# Altium project SCH-29364_a.PrjPcb (part 1 of 3)
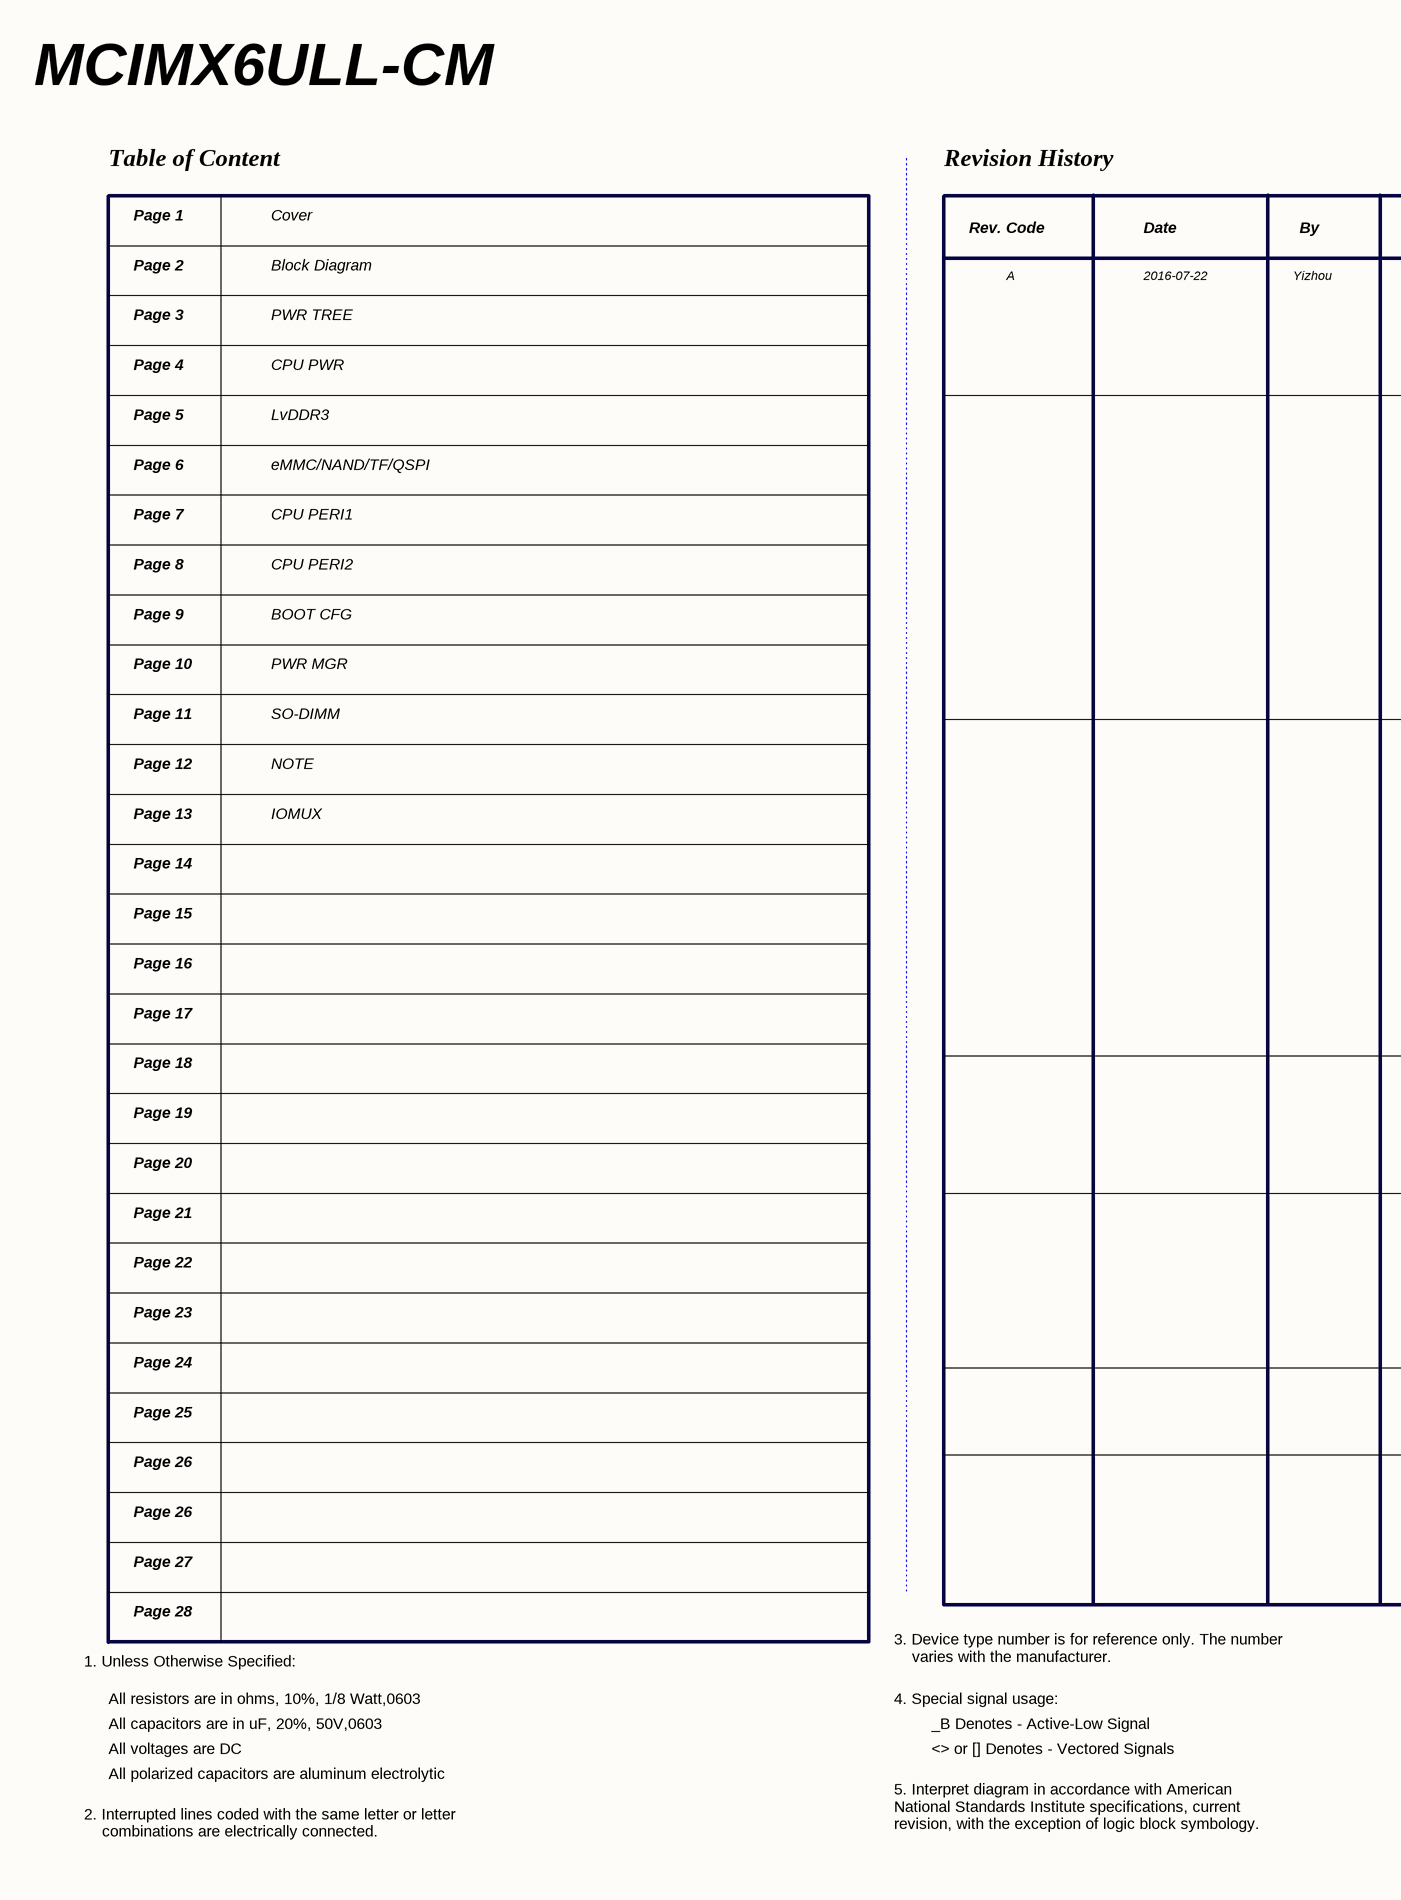
[diagram p0: A-00 COVER.SchDoc, left]
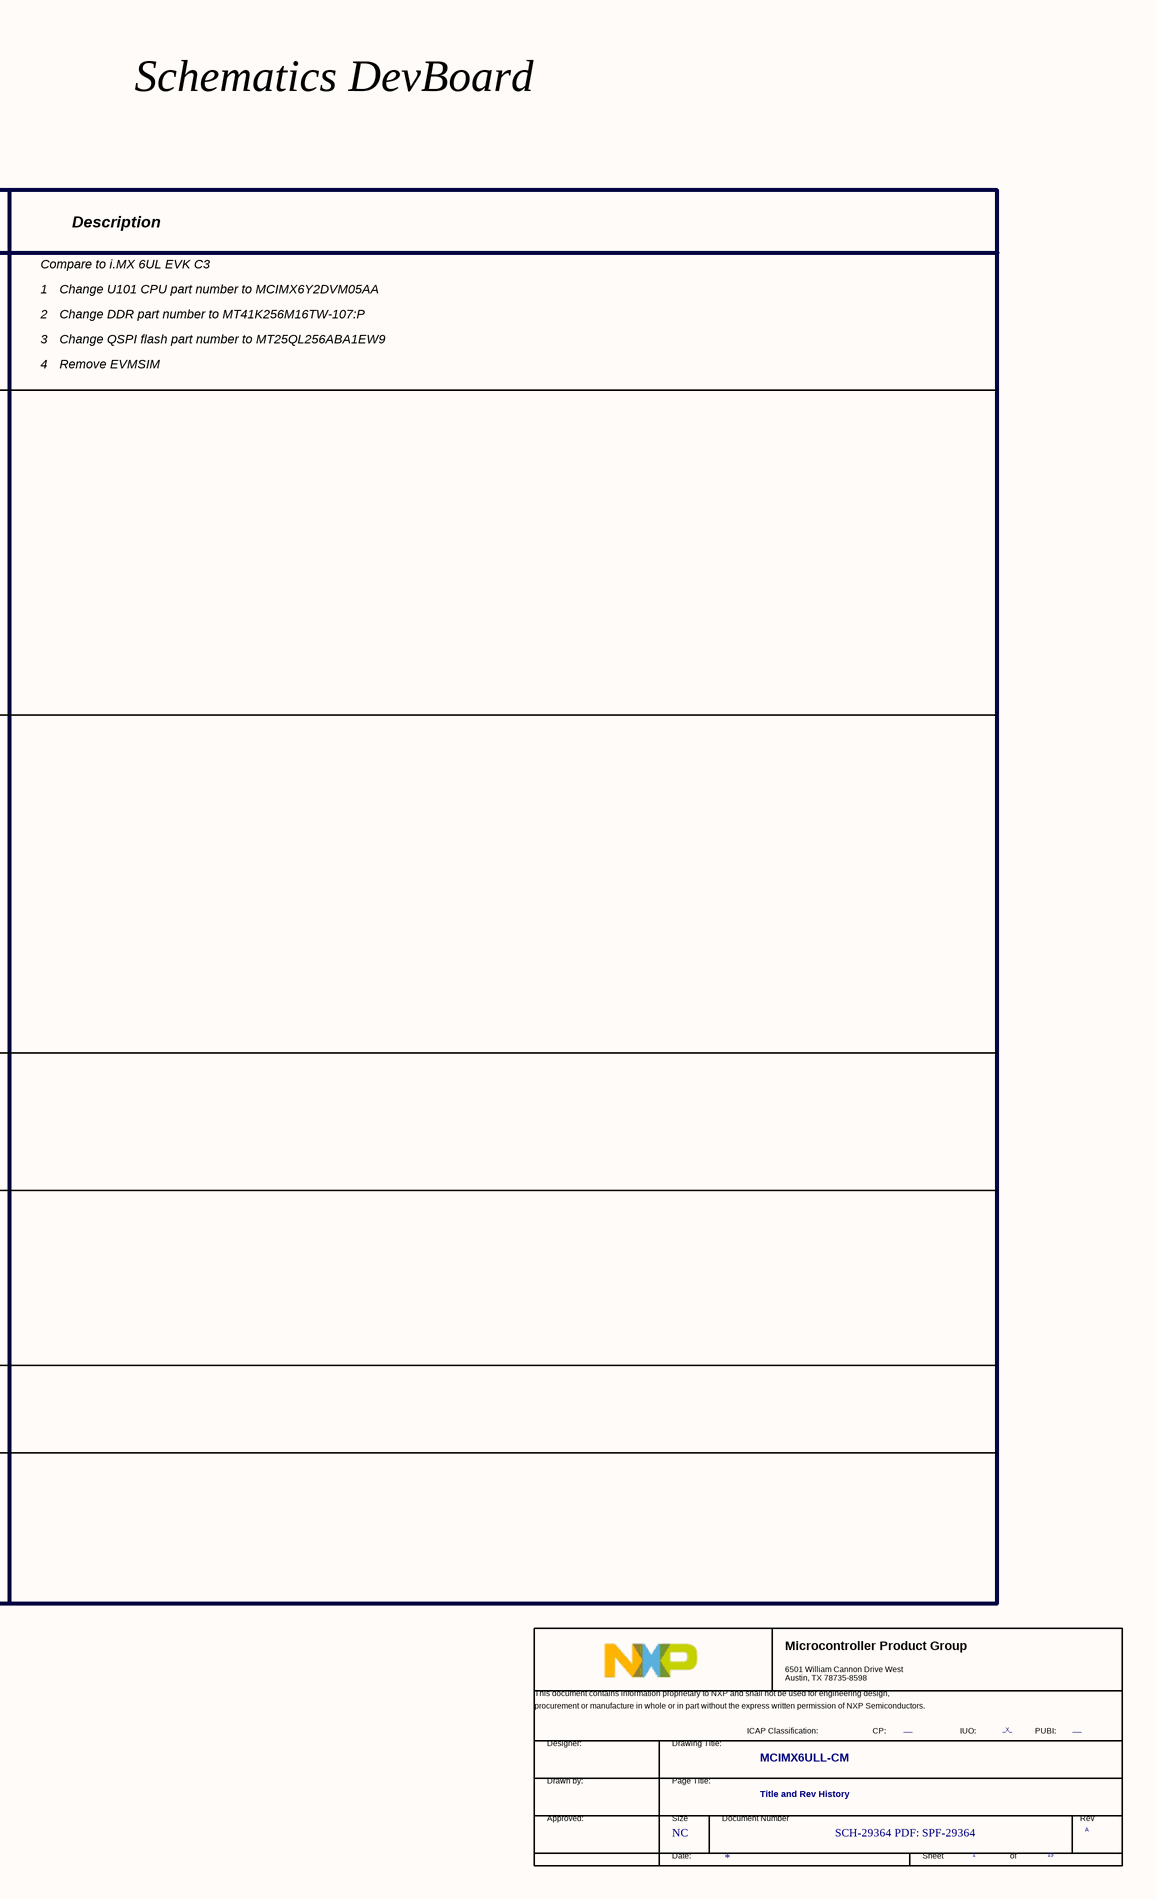
[diagram p1: A-00 COVER.SchDoc, right]
12 sheets, 344 parts. Net scope: global (net labels, ports and power ports of the same name join across sheets).
Board file: PCB1.PcbDoc
Sheets:
  A-00 COVER.SchDoc
  A-01 BLOCK DIAGRAM.SchDoc
  A-02 PWR TREE.SchDoc
  C-01 CPU PWR.SchDoc
  C-02 LvDDR3.SchDoc
  C-03 eMMC_NAND_TF_QSPI.SchDoc
  C-04 CPU PERI1.SchDoc
  C-05 CPU PERI2.SchDoc
  C-06 BOOT CFG.SchDoc
  C-07 PWR MGR.SchDoc
  X-01 NOTE.SchDoc
  X-02 IOMUX.SchDoc

## Sheet A-00 COVER.SchDoc
size 513 x 386 mm

### Parts
(Parts that share a designator on the sheet are numbered #1, #2 ... from top to bottom, then left to right.)
*#1  Doc: SCH-29364 PDF: SPF-29364  RevCode: A  Title: MCIMX6ULL-CM  Page Size: NC  Page Number: 1  Page Count: 13  PageTitle: Title and Rev History  PUBI: ___  FIUO: _X_  (hidden comment: TitleBlock_MCPG)  (graphical)

### Notes on the sheet
- MCIMX6ULL-CM
- Schematics DevBoard
- Table of Content
- Page 1
- Cover
- Revision History
- Page 2
- Block Diagram
- Rev. Code
- A
- Date
- 2016-07-22
- Yizhou
- By
- Compare to i.MX 6UL EVK C3
- Description
- Page 3
- PWR TREE
- 1
- 2
- Change U101 CPU part number to MCIMX6Y2DVM05AA
- Change DDR part number to MT41K256M16TW-107:P
- Page 4
- CPU PWR
- 3
- 4
- Change QSPI flash part number to MT25QL256ABA1EW9
- Remove EVMSIM
- Page 5
- Page 6
- LvDDR3
- eMMC/NAND/TF/QSPI
- Page 7
- CPU PERI1
- Page 8
- CPU PERI2
- Page 9
- BOOT CFG
- Page 10
- Page 11
- SO-DIMM
- PWR MGR
- Page 12
- NOTE
- Page 13
- IOMUX
- Page 14
- Page 15
- Page 16
- Page 17
- Page 18
- Page 19
- Page 20
- Page 21
- Page 22
- Page 23
- Page 24
- Page 25
- Page 26
- Page 27
- Page 28
- 3. Device type number is for reference only. The number
  varies with the manufacturer.
- 1. Unless Otherwise Specified:
- All resistors are in ohms, 10%, 1/8 Watt,0603
- 4. Special signal usage:
- All capacitors are in uF, 20%, 50V,0603
- All voltages are DC
- All polarized capacitors are aluminum electrolytic
- 5. Interpret diagram in accordance with American
  National Standards Institute specifications, current
  revision, with the exception of logic block symbology.
- _B Denotes - Active-Low Signal
- <> or [] Denotes - Vectored Signals
- 2. Interrupted lines coded with the same letter or letter
  combinations are electrically connected.
- (in symbol TitleBlock_MCPG) Microcontroller Product Group; 6501 William Cannon Drive West / Austin, TX 78735-8598; This document contains information proprietary to NXP and shall not be used for engineering design,; procurement or manufacture in whole or in part without the express written permission of NXP Semiconductors.; ICAP Classification:; CP:; IUO:; PUBI:; Designer:; Drawing Title:; Drawn by:; Page Title:; Approved:; Size; Document Number; Rev; Date:; Sheet; of

### Library data of the parts
*#1 = TitleBlock_MCPG: OrgAddr2: Austin, TX 78735-8598; OrgAddr1: 6501 William Cannon Drive West; OrgName: Freescale Semiconductor; Page Create Date: March  8, 1995; FCP: ___; Page Modify Date: *

## Sheet A-01 BLOCK DIAGRAM.SchDoc
size 513 x 386 mm
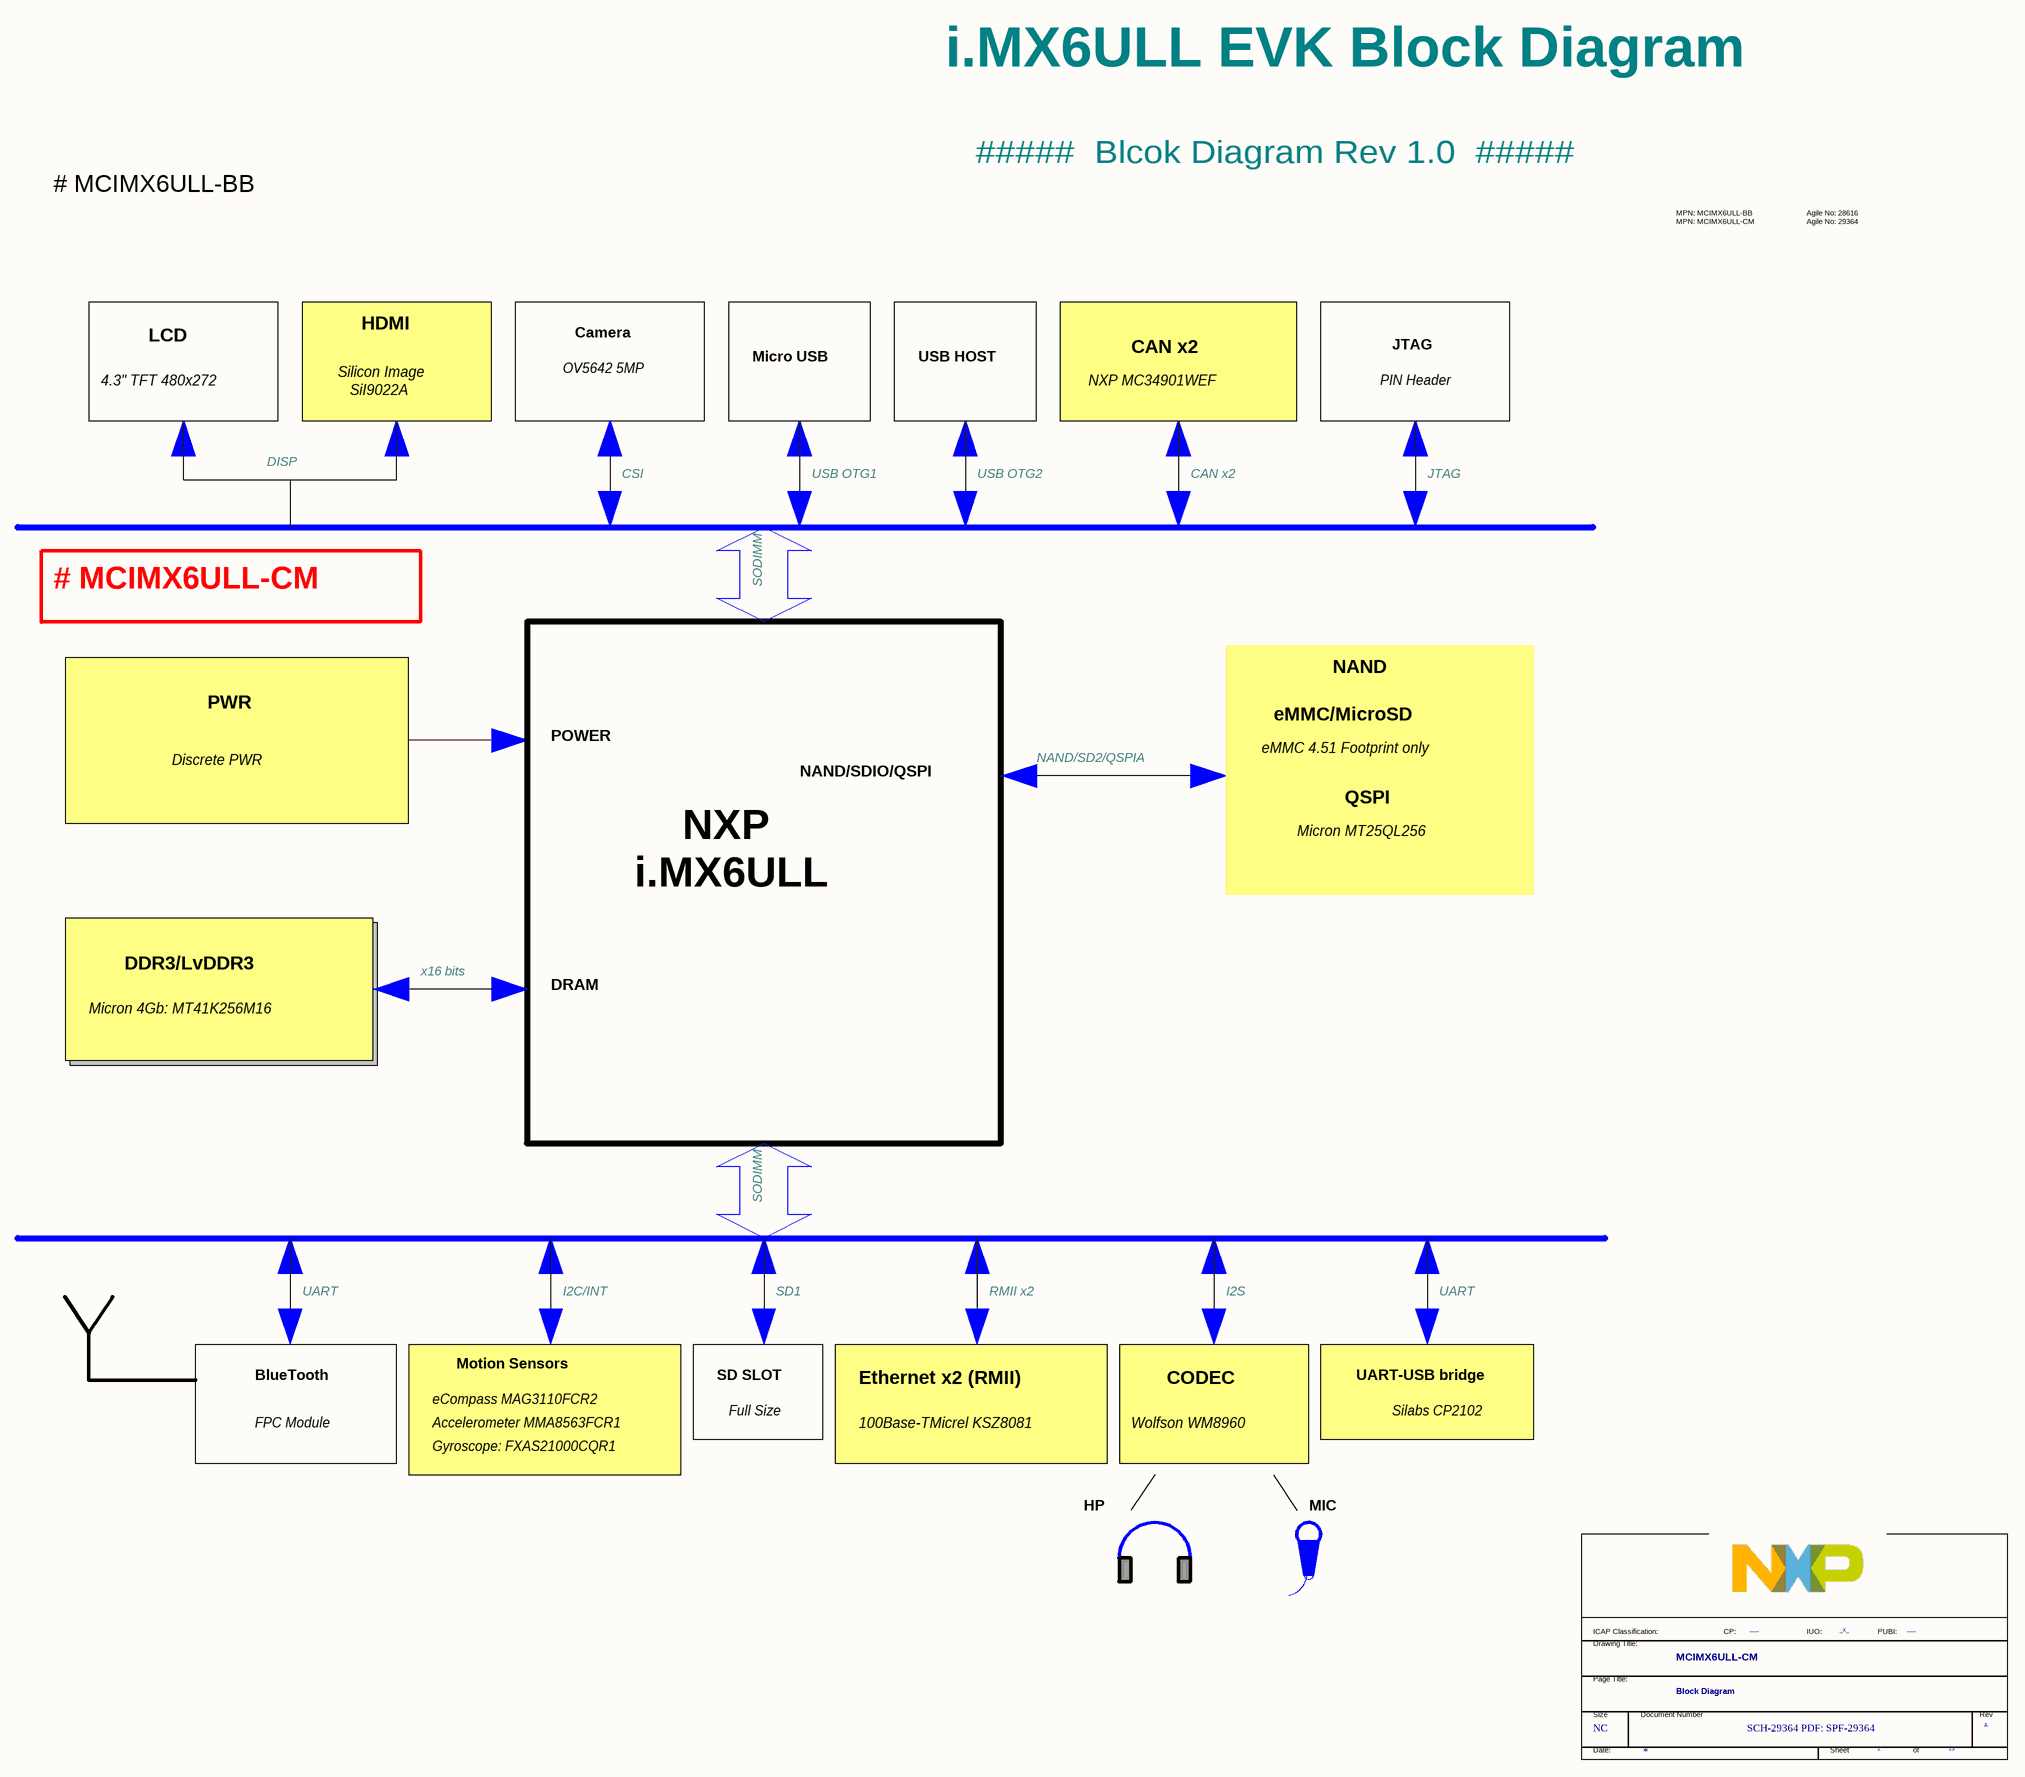
[diagram p2: A-01 BLOCK DIAGRAM.SchDoc]

### Parts
(Parts that share a designator on the sheet are numbered #1, #2 ... from top to bottom, then left to right.)
*#2  FIUO: _X_  PUBI: ___  Doc: SCH-29364 PDF: SPF-29364  RevCode: A  Title: MCIMX6ULL-CM  Page Size: NC  Page Number: 2  Page Count: 13  PageTitle: Block Diagram  (hidden comment: TitleBlock_FS)  (graphical)

### Notes on the sheet
- i.MX6ULL EVK Block Diagram
- # MCIMX6ULL-BB
- #####  Blcok Diagram Rev 1.0  #####
- MPN: MCIMX6ULL-BB
  MPN: MCIMX6ULL-CM
- Agile No: 28616
  Agile No: 29364
- LCD
- Silicon Image
  SiI9022A
- HDMI
- OV5642 5MP
- Camera
- Micro USB
- USB HOST
- CAN x2
- JTAG
- 4.3" TFT 480x272
- NXP MC34901WEF
- PIN Header
- DISP
- CSI
- USB OTG1
- USB OTG2
- # MCIMX6ULL-CM
- SODIMM
- PWR
- eMMC/MicroSD
- NAND
- Discrete PWR
- POWER
- NAND/SDIO/QSPI
- NAND/SD2/QSPIA
- eMMC 4.51 Footprint only
- NXP
  i.MX6ULL
- Micron MT25QL256
- QSPI
- Micron 4Gb: MT41K256M16
- DDR3/LvDDR3
- x16 bits
- DRAM
- UART
- I2C/INT
- SD1
- RMII x2
- I2S
- BlueTooth
- Motion Sensors
- SD SLOT
- UART-USB bridge
- FPC Module
- eCompass MAG3110FCR2
- Accelerometer MMA8563FCR1
- Full Size
- Ethernet x2 (RMII)
- 100Base-TMicrel KSZ8081
- Wolfson WM8960
- CODEC
- Silabs CP2102
- Gyroscope: FXAS21000CQR1
- HP
- MIC
- (in symbol TitleBlock_FS) ICAP Classification:; CP:; IUO:; PUBI:; Drawing Title:; Page Title:; Size; Document Number; Rev; Date:; Sheet; of

### Library data of the parts
*#2 = TitleBlock_FS: OrgName: Freescale Semiconductor; OrgAddr1: 6501 William Cannon Drive West; OrgAddr2: Austin, TX 78735-8598; FCP: ___; Page Create Date: March  8, 1995; Page Modify Date: *

## Sheet A-02 PWR TREE.SchDoc
size 513 x 386 mm
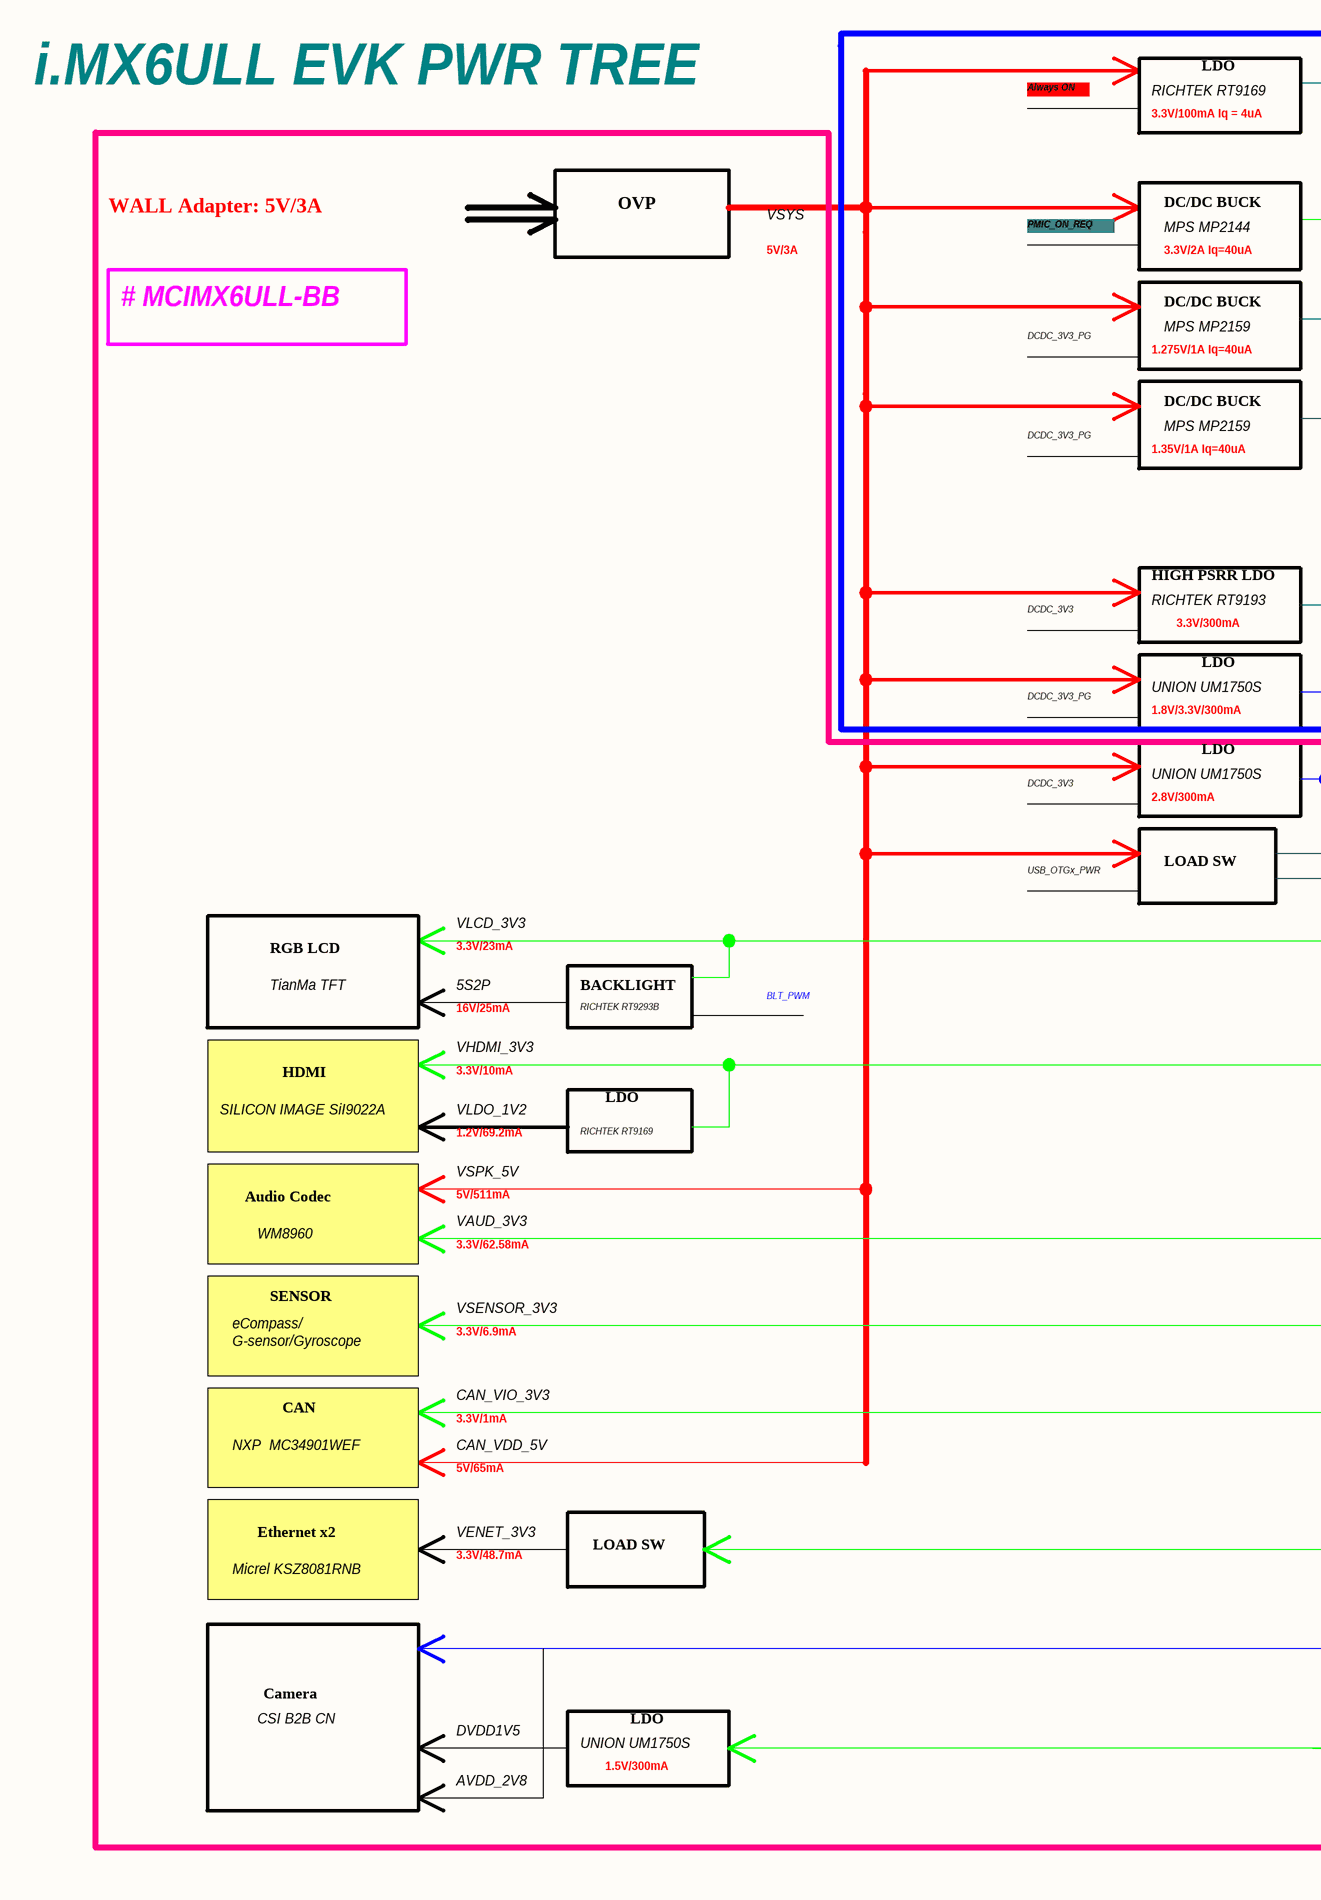
[diagram p3: A-02 PWR TREE.SchDoc, left]
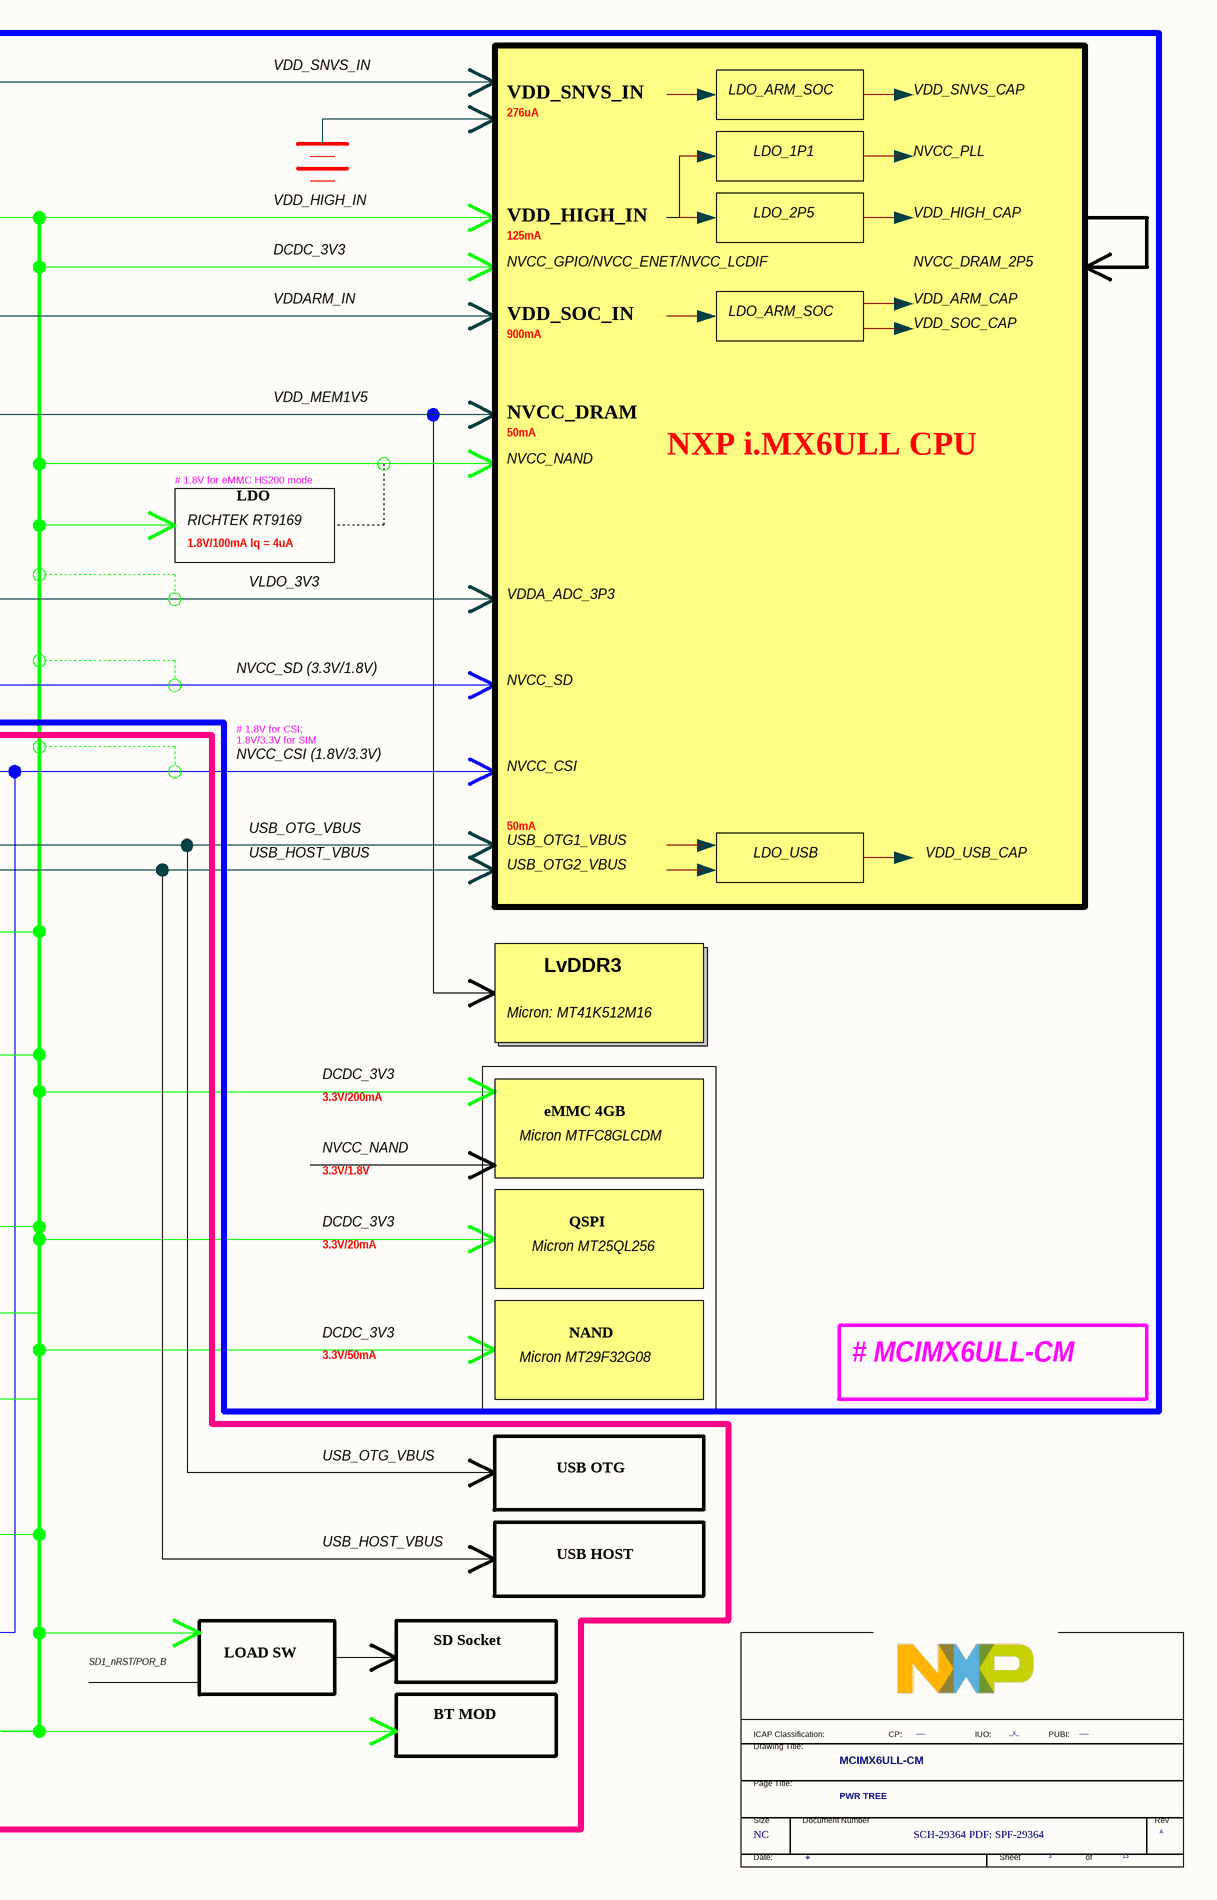
[diagram p4: A-02 PWR TREE.SchDoc, right]

### Parts
(Parts that share a designator on the sheet are numbered #1, #2 ... from top to bottom, then left to right.)
*#3  FIUO: _X_  PUBI: ___  Doc: SCH-29364 PDF: SPF-29364  RevCode: A  Title: MCIMX6ULL-CM  Page Size: NC  Page Number: 3  Page Count: 13  PageTitle: PWR TREE  (hidden comment: TitleBlock_FS)  (graphical)

### Notes on the sheet
- i.MX6ULL EVK PWR TREE
- Always ON
- RICHTEK RT9169
- 3.3V/100mA Iq = 4uA
- LDO
- VDD_SNVS_IN
- 276uA
- LDO_ARM_SOC
- VDD_SNVS_CAP
- LDO_1P1
- NVCC_PLL
- WALL Adapter: 5V/3A
- OVP
- VSYS
- PMIC_ON_REQ
- DC/DC BUCK
- MPS MP2144
- VDD_HIGH_IN
- 125mA
- LDO_2P5
- VDD_HIGH_CAP
- 5V/3A
- 3.3V/2A Iq=40uA
- DCDC_3V3
- VDDARM_IN
- NVCC_GPIO/NVCC_ENET/NVCC_LCDIF
- NVCC_DRAM_2P5
- VDD_ARM_CAP
- # MCIMX6ULL-BB
- DCDC_3V3_PG
- 1.275V/1A Iq=40uA
- MPS MP2159
- 900mA
- VDD_SOC_IN
- VDD_SOC_CAP
- VDD_MEM1V5
- NVCC_DRAM
- 1.35V/1A Iq=40uA
- # 1.8V for eMMC HS200 mode
- NVCC_NAND
- 50mA
- NXP i.MX6ULL CPU
- 1.8V/100mA Iq = 4uA
- RICHTEK RT9193
- HIGH PSRR LDO
- VLDO_3V3
- VDDA_ADC_3P3
- 3.3V/300mA
- NVCC_SD (3.3V/1.8V)
- UNION UM1750S
- 1.8V/3.3V/300mA
- NVCC_SD
- 2.8V/300mA
- NVCC_CSI (1.8V/3.3V)
- # 1.8V for CSI;
  1.8V/3.3V for SIM
- NVCC_CSI
- LOAD SW
- USB_HOST_VBUS
- USB_OTG_VBUS
- USB_OTG1_VBUS
- LDO_USB
- VDD_USB_CAP
- VLCD_3V3
- USB_OTGx_PWR
- USB_OTG2_VBUS
- TianMa TFT
- RGB LCD
- 5S2P
- 3.3V/23mA
- BACKLIGHT
- LvDDR3
- VHDMI_3V3
- 16V/25mA
- RICHTEK RT9293B
- BLT_PWM
- Micron: MT41K512M16
- SILICON IMAGE SiI9022A
- HDMI
- VLDO_1V2
- 3.3V/10mA
- 3.3V/200mA
- VSPK_5V
- 1.2V/69.2mA
- Micron MTFC8GLCDM
- eMMC 4GB
- Audio Codec
- WM8960
- VAUD_3V3
- 5V/511mA
- 3.3V/1.8V
- QSPI
- SENSOR
- 3.3V/62.58mA
- 3.3V/20mA
- Micron MT25QL256
- eCompass/
  G-sensor/Gyroscope
- 3.3V/6.9mA
- VSENSOR_3V3
- NAND
- CAN
- 3.3V/1mA
- CAN_VIO_3V3
- 3.3V/50mA
- Micron MT29F32G08
- # MCIMX6ULL-CM
- NXP  MC34901WEF
- 5V/65mA
- CAN_VDD_5V
- USB OTG
- Ethernet x2
- VENET_3V3
- Micrel KSZ8081RNB
- 3.3V/48.7mA
- USB HOST
- SD Socket
- CSI B2B CN
- Camera
- DVDD1V5
- SD1_nRST/POR_B
- BT MOD
- AVDD_2V8
- 1.5V/300mA
- (in symbol TitleBlock_FS) ICAP Classification:; CP:; IUO:; PUBI:; Drawing Title:; Page Title:; Size; Document Number; Rev; Date:; Sheet; of

### Library data of the parts
*#3 = TitleBlock_FS: OrgAddr2: Austin, TX 78735-8598; OrgAddr1: 6501 William Cannon Drive West; OrgName: Freescale Semiconductor; FCP: ___; Page Create Date: March  8, 1995; Page Modify Date: *

## Sheet C-01 CPU PWR.SchDoc
size 513 x 386 mm
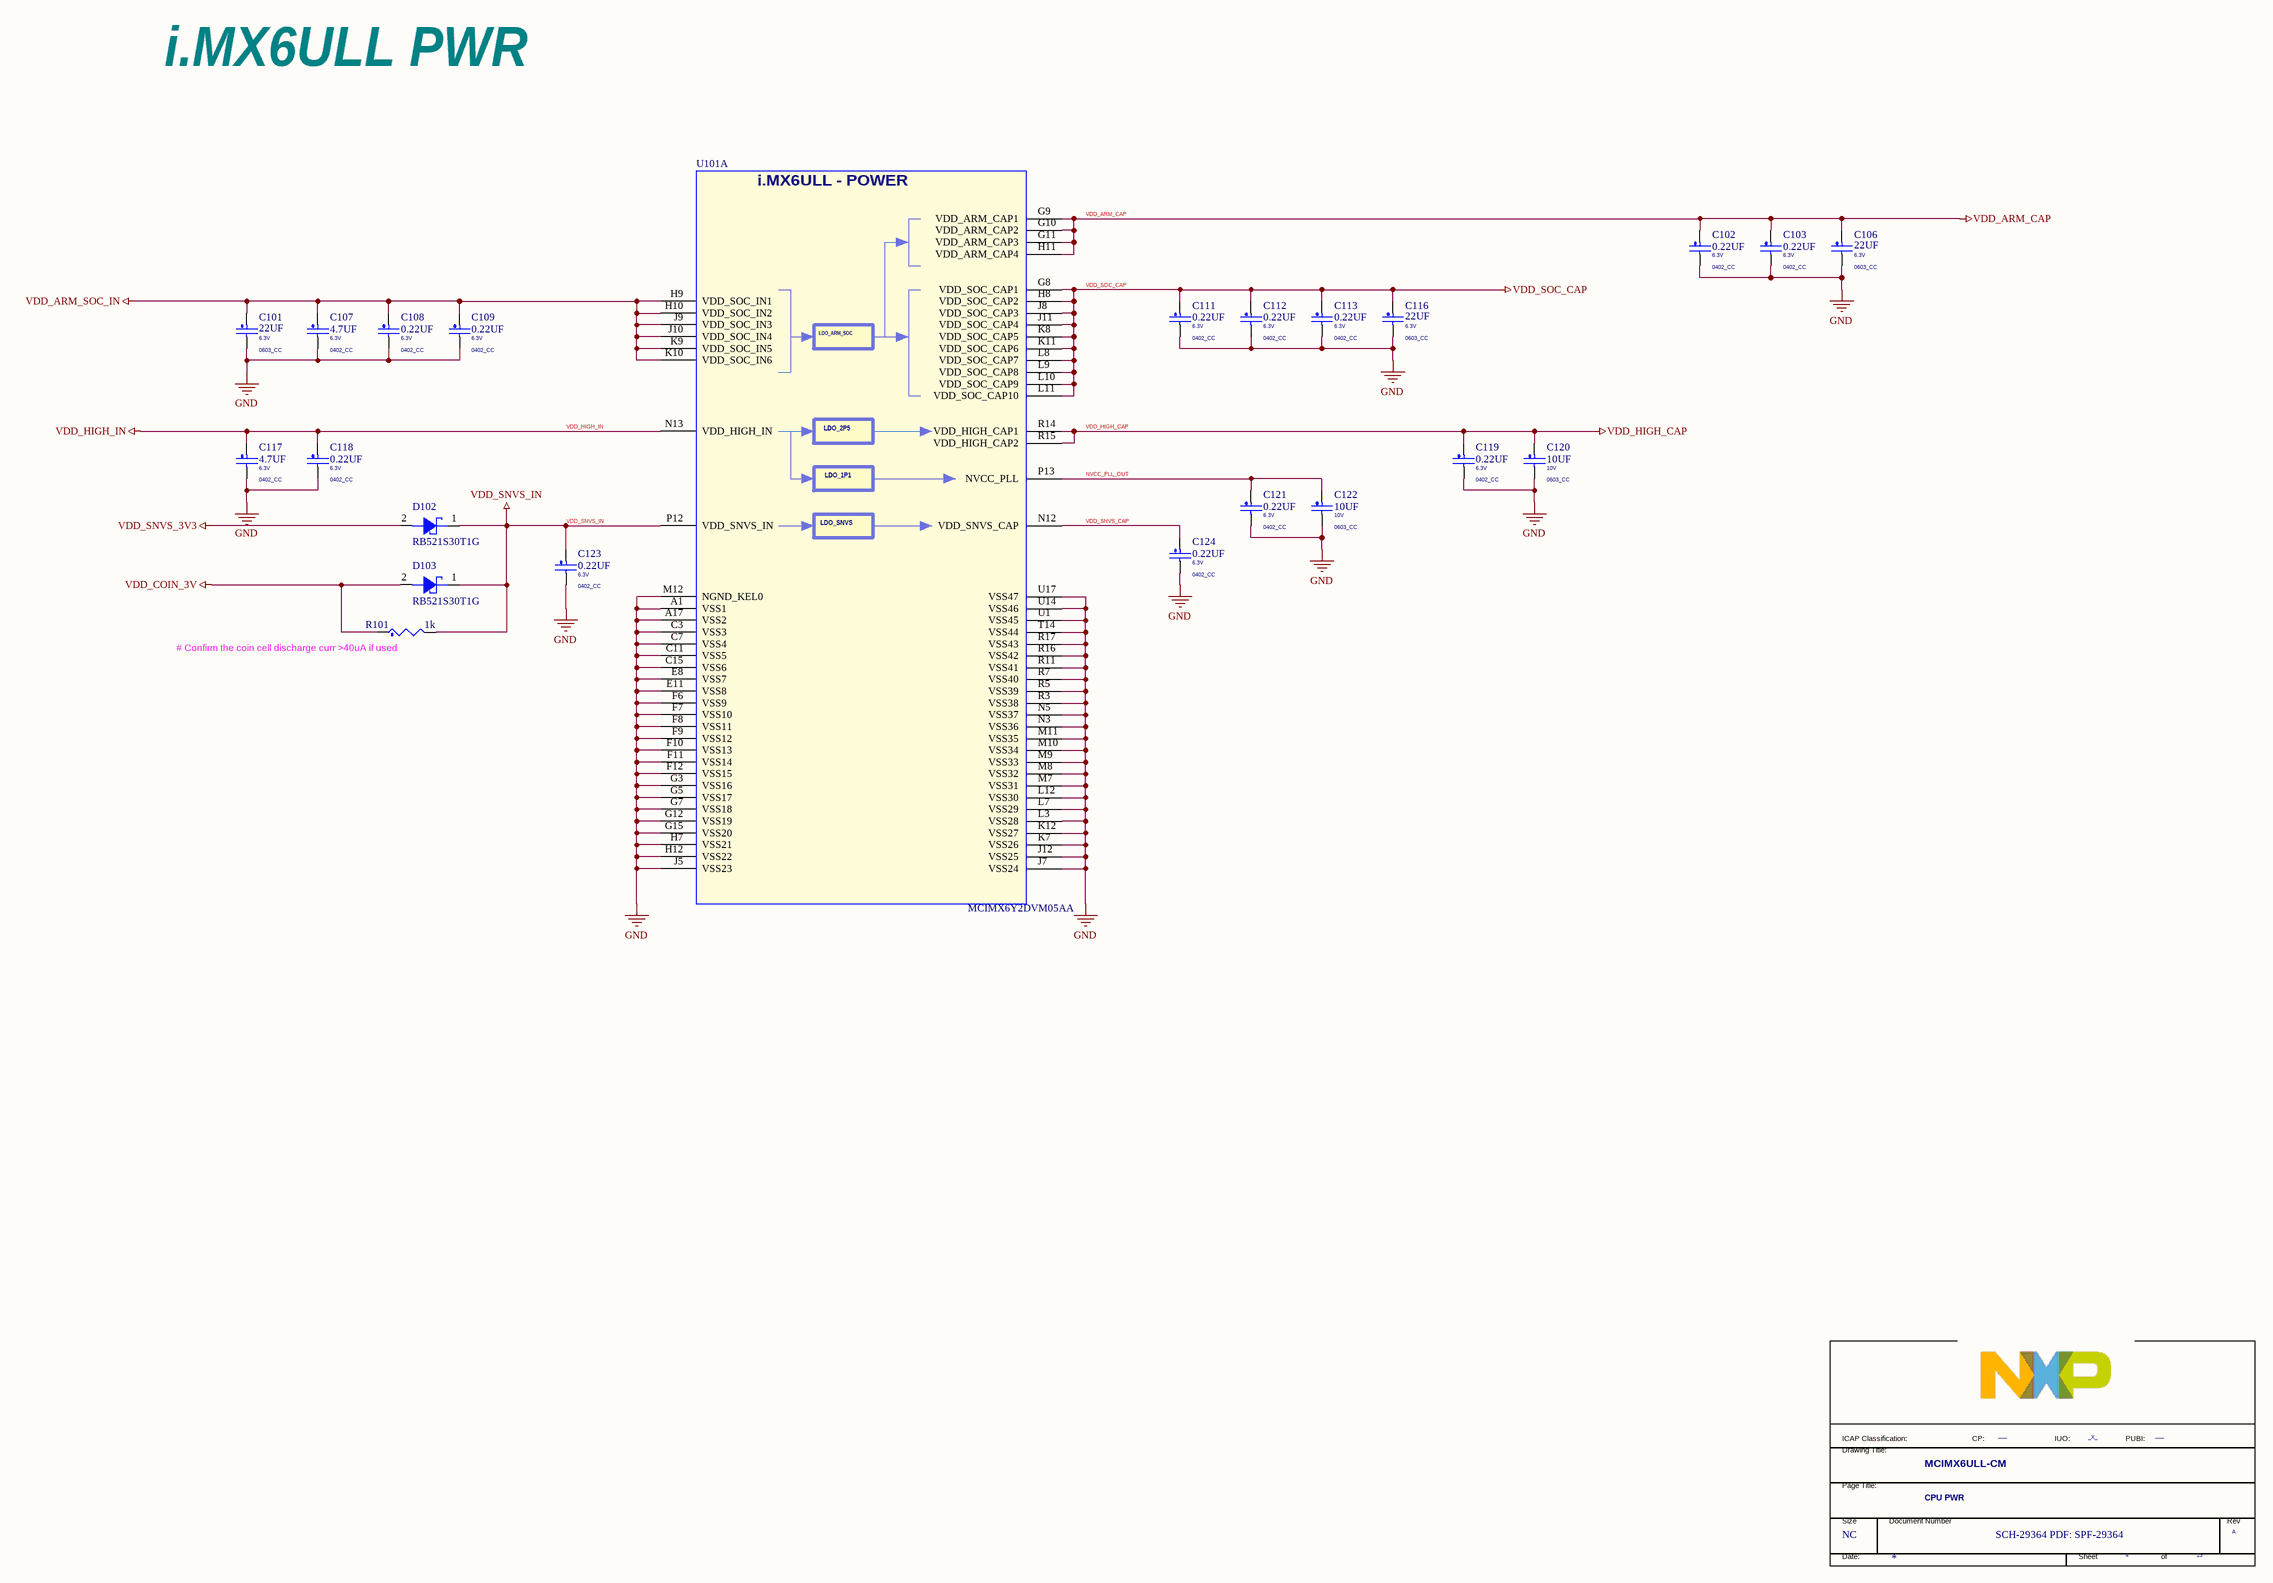
[diagram p5: C-01 CPU PWR.SchDoc]

### Parts
(Parts that share a designator on the sheet are numbered #1, #2 ... from top to bottom, then left to right.)
*#4  FIUO: _X_  PUBI: ___  Doc: SCH-29364 PDF: SPF-29364  RevCode: A  Title: MCIMX6ULL-CM  Page Size: NC  Page Number: 4  Page Count: 13  PageTitle: CPU PWR  (hidden comment: TitleBlock_FS)  (graphical)
C101  22UF  voltage rating: 6.3V  PCB Footprint: 0603_CC  [C0603_H0.8mm]  (net tie, no BOM)
C102  0.22UF  VOLTAGE: 6.3V  PCB Footprint: 0402_CC  [C0402_H0.5mm]
C103  0.22UF  VOLTAGE: 6.3V  PCB Footprint: 0402_CC  [C0402_H0.5mm]
C106  22UF  VOLTAGE: 6.3V  PCB Footprint: 0603_CC  [C0603_H0.8mm]
C107  4.7UF  voltage rating: 6.3V  PCB Footprint: 0402_CC  [C0402_H0.5mm]
C108  0.22UF  VOLTAGE: 6.3V  PCB Footprint: 0402_CC  [C0402_H0.5mm]
C109  0.22UF  VOLTAGE: 6.3V  PCB Footprint: 0402_CC  [C0402_H0.5mm]
C111  0.22UF  VOLTAGE: 6.3V  PCB Footprint: 0402_CC  [C0402_H0.5mm]
C112  0.22UF  VOLTAGE: 6.3V  PCB Footprint: 0402_CC  [C0402_H0.5mm]
C113  0.22UF  VOLTAGE: 6.3V  PCB Footprint: 0402_CC  [C0402_H0.5mm]
C116  22UF  VOLTAGE: 6.3V  PCB Footprint: 0603_CC  [C0603_H0.8mm]
C117  4.7UF  voltage rating: 6.3V  PCB Footprint: 0402_CC  [C0402_H0.5mm]
C118  0.22UF  VOLTAGE: 6.3V  PCB Footprint: 0402_CC  [C0402_H0.5mm]
C119  0.22UF  VOLTAGE: 6.3V  PCB Footprint: 0402_CC  [C0402_H0.5mm]
C120  10UF  VOLTAGE: 10V  PCB Footprint: 0603_CC  [C0603_H0.8mm]
C121  0.22UF  VOLTAGE: 6.3V  PCB Footprint: 0402_CC  [C0402_H0.5mm]
C122  10UF  VOLTAGE: 10V  PCB Footprint: 0603_CC  [C0603_H0.8mm]
C123  0.22UF  VOLTAGE: 6.3V  PCB Footprint: 0402_CC  [C0402_H0.5mm]
C124  0.22UF  VOLTAGE: 6.3V  PCB Footprint: 0402_CC  [C0402_H0.5mm]
D102  RB521S30T1G  [SOD-523_1.2x0.8mm]
D103  RB521S30T1G  [SOD-523_1.2x0.8mm]
R101  1k  [R0402_H0.35mm]
U101  MCIMX6Y2DVM05AA  [BGA289_14x14mm]  (part A of 11)

### Nets
GND: C101.2 C102.2 C103.2 C106.2 C107.2 C108.2 C109.2 C111.2 C112.2 C113.2 C116.2 C117.2 C118.2 C119.2 C120.2 C121.2 C122.2 C123.2 C124.2 U101.A1(VSS1) U101.A17(VSS2) U101.C3(VSS3) U101.C7(VSS4) U101.C11(VSS5) U101.C15(VSS6) U101.E8(VSS7) U101.E11(VSS8) U101.F6(VSS9) U101.F7(VSS10) U101.F8(VSS11) U101.F9(VSS12) U101.F10(VSS13) U101.F11(VSS14) U101.F12(VSS15) U101.G3(VSS16) U101.G5(VSS17) U101.G7(VSS18) U101.G12(VSS19) U101.G15(VSS20) U101.H7(VSS21) U101.H12(VSS22) U101.J5(VSS23) U101.J7(VSS24) U101.J12(VSS25) U101.K7(VSS26) U101.K12(VSS27) U101.L3(VSS28) U101.L7(VSS29) U101.L12(VSS30) U101.M7(VSS31) U101.M8(VSS32) U101.M9(VSS33) U101.M10(VSS34) U101.M11(VSS35) U101.M12(NGND_KEL0) U101.N3(VSS36) U101.N5(VSS37) U101.R3(VSS38) U101.R5(VSS39) U101.R7(VSS40) U101.R11(VSS41) U101.R16(VSS42) U101.R17(VSS43) U101.T14(VSS44) U101.U1(VSS45) U101.U14(VSS46) U101.U17(VSS47)
VDD_ARM_CAP: C102.1 C103.1 C106.1 U101.G9(VDD_ARM_CAP1) U101.G10(VDD_ARM_CAP2) U101.G11(VDD_ARM_CAP3) U101.H11(VDD_ARM_CAP4)
VDD_ARM_SOC_IN: C101.1 C107.1 C108.1 C109.1 U101.H9(VDD_SOC_IN1) U101.H10(VDD_SOC_IN2) U101.J9(VDD_SOC_IN3) U101.J10(VDD_SOC_IN4) U101.K9(VDD_SOC_IN5) U101.K10(VDD_SOC_IN6)
VDD_COIN_3V: D103.2(A) R101.1
VDD_HIGH_CAP: C119.1 C120.1 U101.R14(VDD_HIGH_CAP1) U101.R15(VDD_HIGH_CAP2)
VDD_HIGH_IN: C117.1 C118.1 U101.N13(VDD_HIGH_IN)
VDD_SNVS_3V3: D102.2(A)
VDD_SNVS_IN: C123.1 D102.1(C) D103.1(C) R101.2 U101.P12(VDD_SNVS_IN)
VDD_SOC_CAP: C111.1 C112.1 C113.1 C116.1 U101.G8(VDD_SOC_CAP1) U101.H8(VDD_SOC_CAP2) U101.J8(VDD_SOC_CAP3) U101.J11(VDD_SOC_CAP4) U101.K8(VDD_SOC_CAP5) U101.K11(VDD_SOC_CAP6) U101.L8(VDD_SOC_CAP7) U101.L9(VDD_SOC_CAP8) U101.L10(VDD_SOC_CAP9) U101.L11(VDD_SOC_CAP10)
NVCC_PLL_OUT: C121.1 C122.1 U101.P13(NVCC_PLL)
VDD_SNVS_CAP: C124.1 U101.N12(VDD_SNVS_CAP)

### Notes on the sheet
- i.MX6ULL PWR
- (near R101) # Confirm the coin cell discharge curr >40uA if used
- (in symbol MCIMX6Y2DVM05AA_PBGA_289P, part A) i.MX6ULL - POWER; LDO_ARM_SOC; LDO_2P5; LDO_1P1; LDO_SNVS
- (in symbol TitleBlock_FS) ICAP Classification:; CP:; IUO:; PUBI:; Drawing Title:; Page Title:; Size; Document Number; Rev; Date:; Sheet; of

### Library data of the parts
*#4 = TitleBlock_FS: as *#3 on sheet A-02 PWR TREE; FCP: ___; Page Create Date: March  8, 1995; Page Modify Date: *
C101 C106 = CAP_NP: CAP CER 22UF 6.3V 20% X5R 0603; CLASS: DISCRETE; FPLIST: CC0603_OV,CC0603,0603_CC; CAD_APPROVED: Yes; MFG_PN01: CL10A226MQ8NRNE; MFG_NAME01: Samsung; AGILE_PN: 150-78467; HEIGHT: 1MM; ROHS: Yes; Tolerance: 20%
  C101: VOLTAGE: 6.3V
  C106: voltage rating: 6.3V
C102 C103 C108 C109 C118 C119 C123 = CAP_NP: CAP CER 0.22UF 6.3V 20% X5R 0402; CLASS: DISCRETE; FPLIST: CC0402_25,CC0402_HD,0402_CC; CAD_APPROVED: Yes; MFG_PN01: C0402C224M9PAC; MFG_NAME01: KEMET; AGILE_PN: 150-76271; HEIGHT: 0.55MM; ROHS: Yes; Tolerance: 20%
C107 C117 = CAP_NP: CAP CER 4.7UF 6.3V 20% X5R 0402; CLASS: DISCRETE; FPLIST: CC0402_25,CC0402_HD,0402_CC; CAD_APPROVED: Yes; MFG_PN01: C0402X5R6R3-475MNP; MFG_NAME01: VENKEL COMPANY; AGILE_PN: 150-78463; HEIGHT: 0.65MM; ROHS: Yes; Tolerance: 20%; VOLTAGE: 6.3V
C111-C113 C121 C124 = CAP_NP: CAP CER 0.22UF 6.3V 20% X5R 0402; CLASS: DISCRETE; AGILE_PN: 150-76271; MFG_NAME01: KEMET; MFG_PN01: C0402C224M9PAC; CAD_APPROVED: Yes; FPLIST: CC0402_25,CC0402_HD,0402_CC; Tolerance: 20%; ROHS: Yes; HEIGHT: 0.55MM
C116 = CAP_NP: CAP CER 22UF 6.3V 20% X5R 0603; CLASS: DISCRETE; AGILE_PN: 150-78467; MFG_NAME01: Samsung; MFG_PN01: CL10A226MQ8NRNE; CAD_APPROVED: Yes; FPLIST: CC0603_OV,CC0603,0603_CC; voltage rating: 6.3V; Tolerance: 20%; ROHS: Yes; HEIGHT: 1MM
C120 C122 = CAP_NP: CAP CER 10UF 10V 20% X5R 0603; CLASS: DISCRETE; FPLIST: CC0603_OV,CC0603,0603_CC; CAD_APPROVED: Yes; MFG_PN01: LMK107BJ106MALTD; MFG_NAME01: TAIYO YUDEN; AGILE_PN: 150-78609; HEIGHT: 1.016MM; ROHS: Yes
D102 D103 = DIODE_SCHTKY: DIODE SCH 200MA 30V AEC-Q101 SOD-523; CLASS: IC; PCB Footprint: sod_523; AGILE_PN: 480-78501; MFG_NAME01: On Semiconductor; CAD_APPROVED: Yes; MFG_PN01: RB521S30T1G; ROHS: Yes; HEIGHT: 0.7MM
R101 = RES: RES MF 1.0K 1/16W 5% 0402; CLASS: DISCRETE; PCB Footprint: 0402_CC; AGILE_PN: 470-75555; MFG_NAME01: VISHAY INTERTECHNOLOGY; MFG_PN01: CRCW04021K00JNED; CAD_APPROVED: Yes; FPLIST: RC0402_25,RC0402_HD,RC0402_X2,0402_CC; Tolerance: 5%; ROHS: Yes
U101 = MCIMX6Y2DVM05AA_PBGA_289P: IC CPU ARM COREA7 528MHZ 16BIT 1.5V PBGA289; PCB Footprint: BGA289_0P8_14X14; AGILE_PN: TMP-WF-27909; MFG_NAME01: NXP SEMICONDUCTORS; PRE_APN: 330-77022; CAD_APPROVED: Yes; CLASS: IC; MFG_PN01: MCIMX6Y2DVM05AA; ROHS: Yes; HEIGHT: 1.32MM

## Sheet C-02 LvDDR3.SchDoc
size 513 x 386 mm
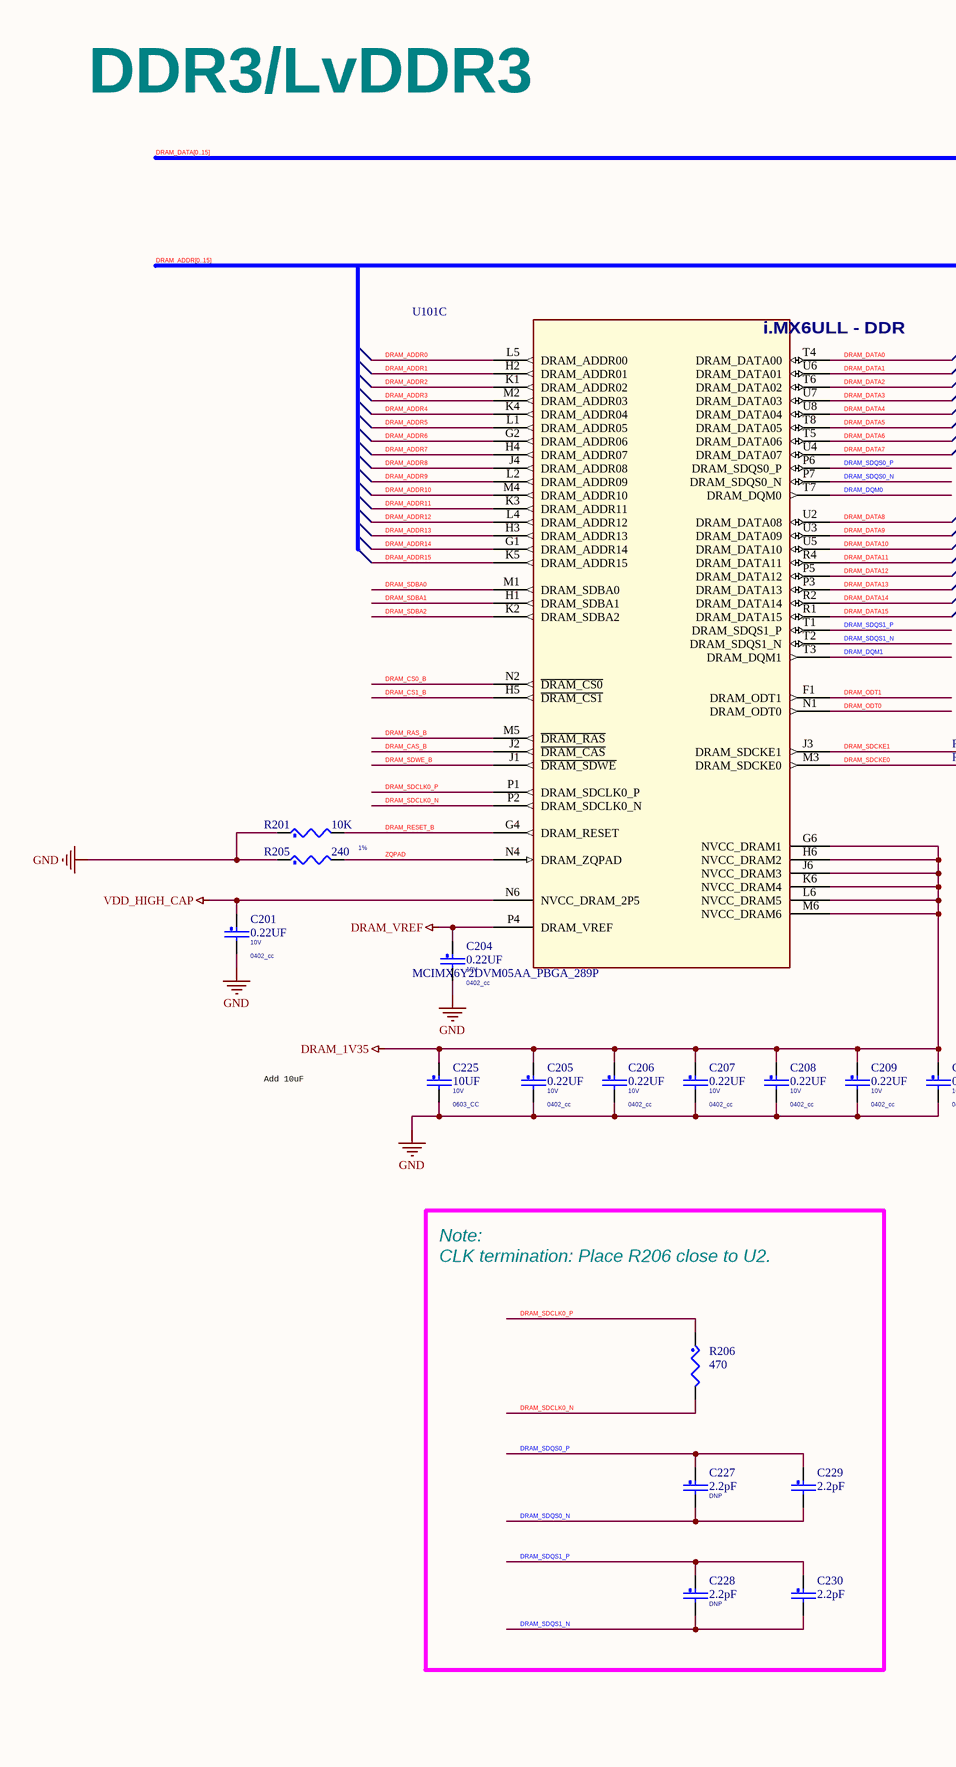
[diagram p6: C-02 LvDDR3.SchDoc, left]
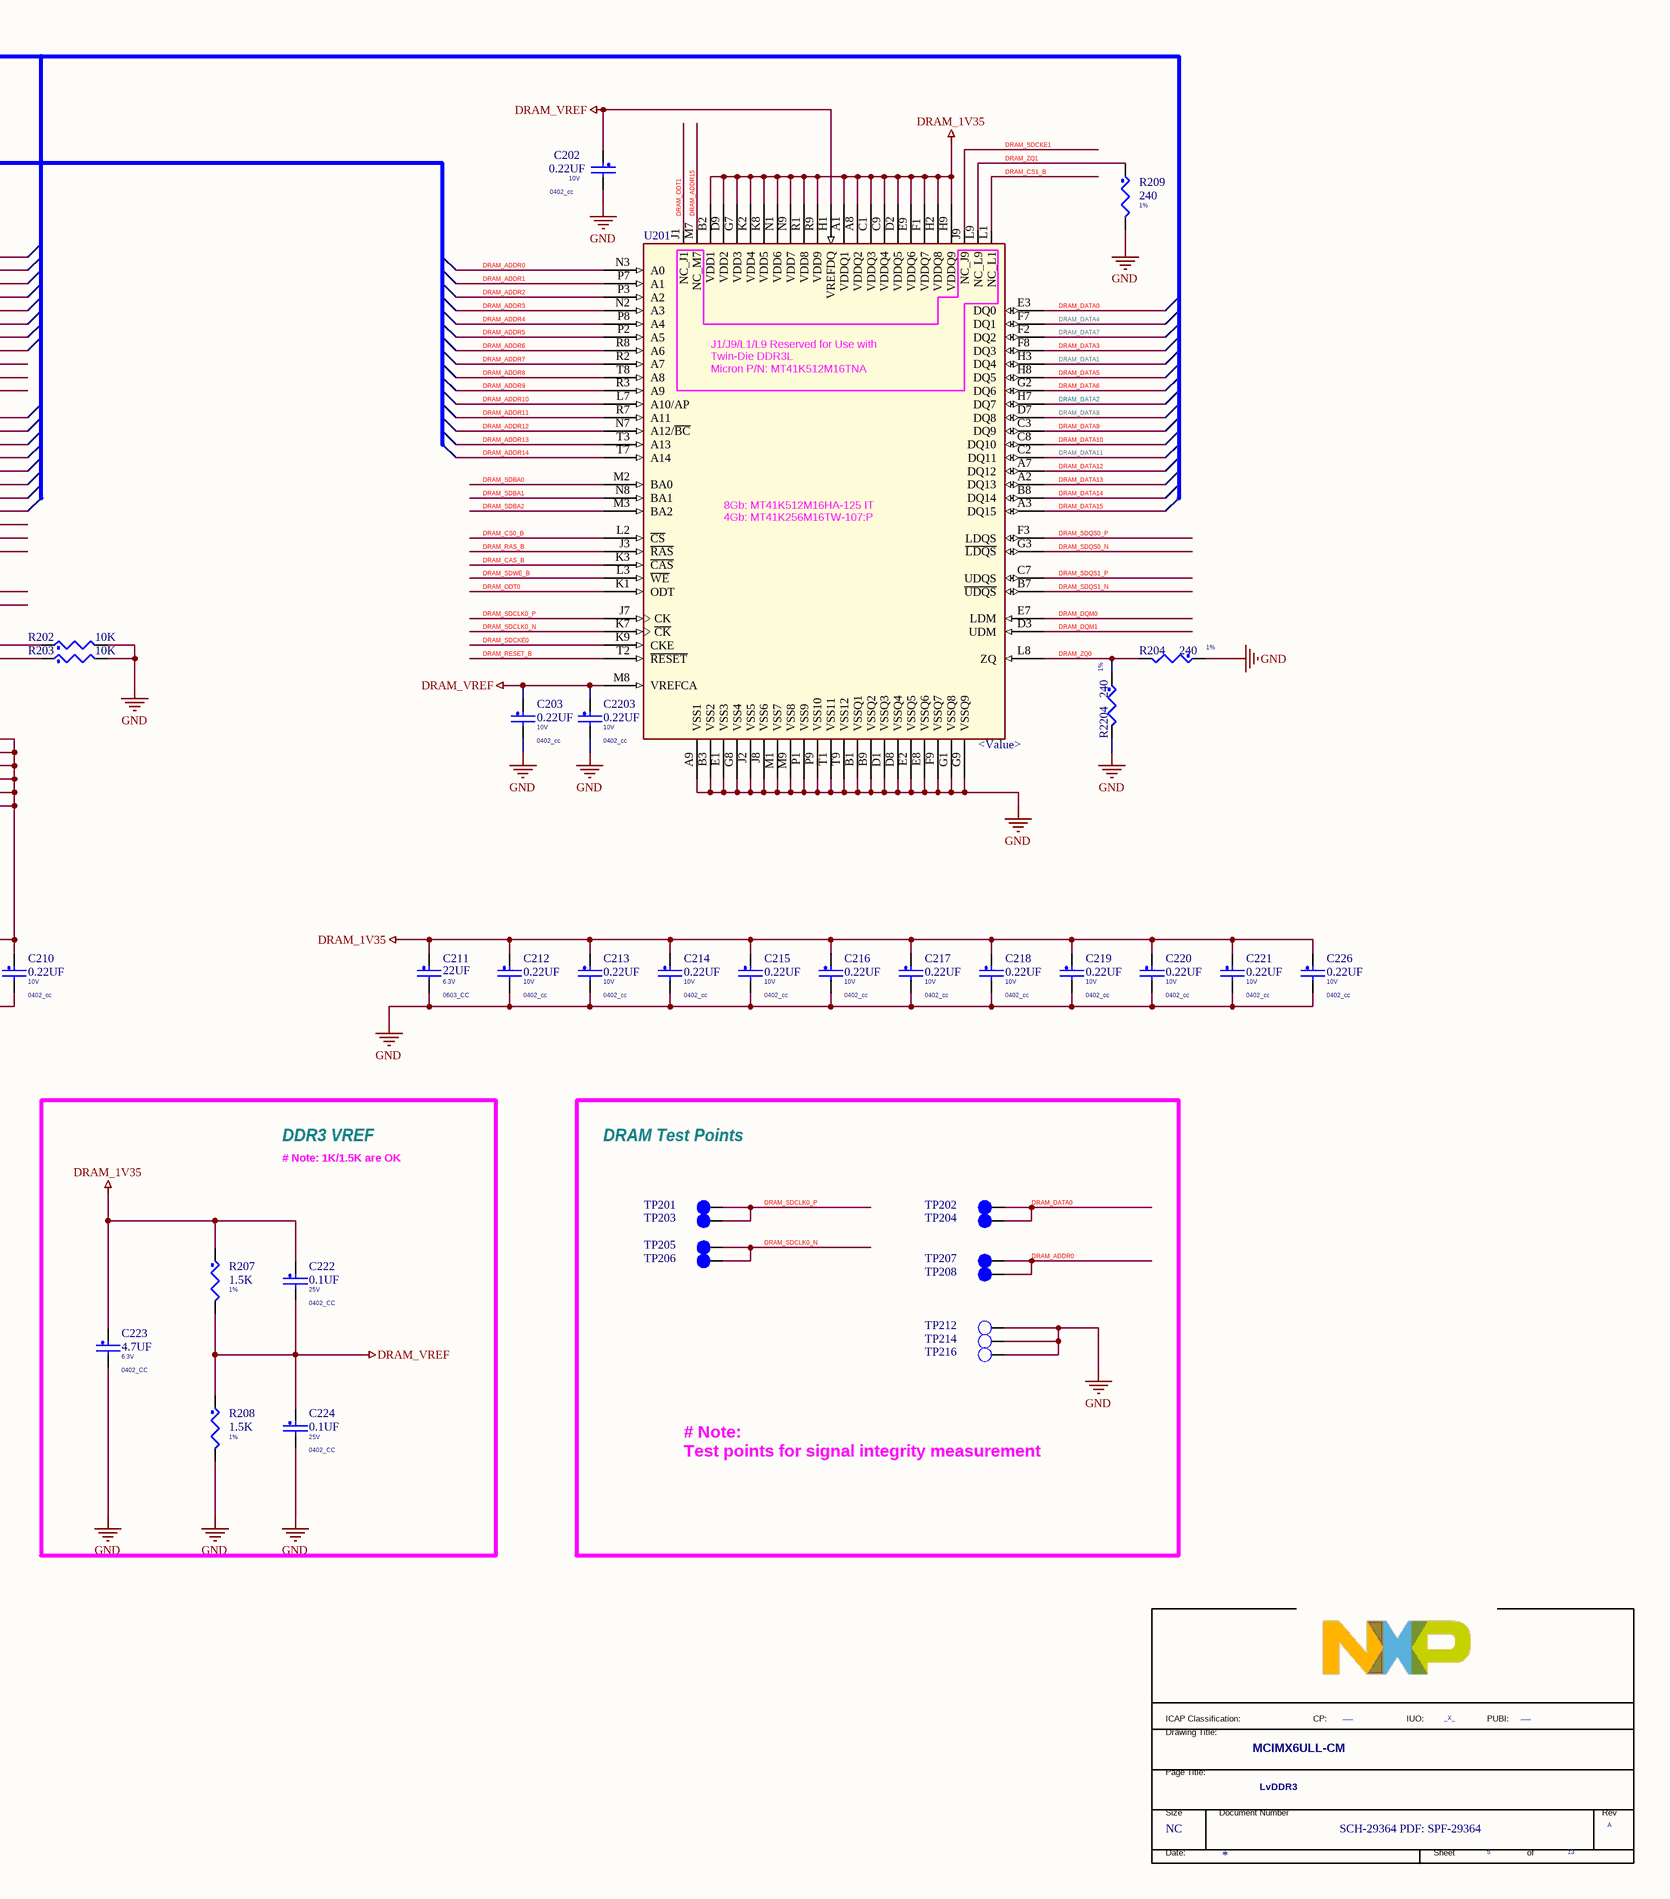
[diagram p7: C-02 LvDDR3.SchDoc, right]

### Parts
(Parts that share a designator on the sheet are numbered #1, #2 ... from top to bottom, then left to right.)
*#5  FIUO: _X_  PUBI: ___  Doc: SCH-29364 PDF: SPF-29364  RevCode: A  Title: MCIMX6ULL-CM  Page Size: NC  Page Number: 5  Page Count: 13  PageTitle: LvDDR3  (hidden comment: TitleBlock_FS)  (graphical)
C201  0.22UF  VOLTAGE: 10V  PCB Footprint: 0402_cc  [C0402_H0.5mm]
C202  0.22UF  VOLTAGE: 10V  PCB Footprint: 0402_cc  [C0402_H0.5mm]
C203  0.22UF  VOLTAGE: 10V  PCB Footprint: 0402_cc  [C0402_H0.5mm]
C204  0.22UF  VOLTAGE: 10V  PCB Footprint: 0402_cc  [C0402_H0.5mm]
C205  0.22UF  VOLTAGE: 10V  PCB Footprint: 0402_cc  [C0402_H0.5mm]
C206  0.22UF  VOLTAGE: 10V  PCB Footprint: 0402_cc  [C0402_H0.5mm]
C207  0.22UF  VOLTAGE: 10V  PCB Footprint: 0402_cc  [C0402_H0.5mm]
C208  0.22UF  VOLTAGE: 10V  PCB Footprint: 0402_cc  [C0402_H0.5mm]
C209  0.22UF  VOLTAGE: 10V  PCB Footprint: 0402_cc  [C0402_H0.5mm]
C210  0.22UF  VOLTAGE: 10V  PCB Footprint: 0402_cc  [C0402_H0.5mm]
C211  22UF  voltage rating: 6.3V  PCB Footprint: 0603_CC  [C0603_H0.8mm]
C212  0.22UF  VOLTAGE: 10V  PCB Footprint: 0402_cc  [C0402_H0.5mm]
C213  0.22UF  VOLTAGE: 10V  PCB Footprint: 0402_cc  [C0402_H0.5mm]
C214  0.22UF  VOLTAGE: 10V  PCB Footprint: 0402_cc  [C0402_H0.5mm]
C215  0.22UF  VOLTAGE: 10V  PCB Footprint: 0402_cc  [C0402_H0.5mm]
C216  0.22UF  VOLTAGE: 10V  PCB Footprint: 0402_cc  [C0402_H0.5mm]
C217  0.22UF  VOLTAGE: 10V  PCB Footprint: 0402_cc  [C0402_H0.5mm]
C218  0.22UF  VOLTAGE: 10V  PCB Footprint: 0402_cc  [C0402_H0.5mm]
C219  0.22UF  VOLTAGE: 10V  PCB Footprint: 0402_cc  [C0402_H0.5mm]
C220  0.22UF  VOLTAGE: 10V  PCB Footprint: 0402_cc  [C0402_H0.5mm]
C221  0.22UF  VOLTAGE: 10V  PCB Footprint: 0402_cc  [C0402_H0.5mm]
C222  0.1UF  VOLTAGE: 25V  PCB Footprint: 0402_CC  [C0402_H0.5mm]
C223  4.7UF  voltage rating: 6.3V  PCB Footprint: 0402_CC  [C0402_H0.5mm]
C224  0.1UF  VOLTAGE: 25V  PCB Footprint: 0402_CC  [C0402_H0.5mm]
C225  10UF  VOLTAGE: 10V  PCB Footprint: 0603_CC  [C0603_H0.8mm]
C226  0.22UF  PCB Footprint: 0402_cc  VOLTAGE: 10V  [C0402_H0.5mm]
C227  2.2pF  ASSY_OPT: DNP  [C0402_H0.5mm]
C228  2.2pF  ASSY_OPT: DNP  [C0402_H0.5mm]
C229  2.2pF  [C0402_H0.5mm]
C230  2.2pF  [C0402_H0.5mm]
C2203  0.22UF  VOLTAGE: 10V  PCB Footprint: 0402_cc  [C0402_H0.5mm]
R201  10K  [R0402_H0.35mm]
R202  10K  [R0402_H0.35mm]
R203  10K  [R0402_H0.35mm]
R204  240  Tolerance: 1%  [R0402_H0.35mm]
R205  240  Tolerance: 1%  [R0402_H0.35mm]
R206  470  [R0402_H0.35mm]
R207  1.5K  Tolerance: 1%  [R0402_H0.35mm]
R208  1.5K  Tolerance: 1%  [R0402_H0.35mm]
R209  240  Tolerance: 1%  [R0402_H0.35mm]
R2204  240  Tolerance: 1%  [R0402_H0.35mm]
TP201  TPAD_015  [TPAD_015]  (value not drawn)
TP202  TPAD_015  [TPAD_015]  (value not drawn)
TP203  TPAD_015  [TPAD_015]  (value not drawn)
TP204  TPAD_015  [TPAD_015]  (value not drawn)
TP205  TPAD_015  [TPAD_015]  (value not drawn)
TP206  TPAD_015  [TPAD_015]  (value not drawn)
TP207  TPAD_015  [TPAD_015]  (value not drawn)
TP208  TPAD_015  [TPAD_015]  (value not drawn)
TP212  TP_35MIL  [TPAD_035]  (value not drawn)
TP214  TP_35MIL  [TPAD_035]  (value not drawn)
TP216  TP_35MIL  [TPAD_035]  (value not drawn)
U101  MCIMX6Y2DVM05AA_PBGA_289P  [BGA289_14x14mm]  (part C of 11)
U201  <Value>  [BGA96_8x14mm]

### Blocks framed on the sheet
DDR3 VREF: C222-C224 R207 R208
DRAM Test Points: TP201-TP208 TP212 TP214 TP216

### Nets
DRAM_1V35: C205.1 C206.1 C207.1 C208.1 C209.1 C210.1 C211.1 C212.1 C213.1 C214.1 C215.1 C216.1 C217.1 C218.1 C219.1 C220.1 C221.1 C222.1 C223.1 C225.1 C226.1 R207.1 U101.G6(NVCC_DRAM1) U101.H6(NVCC_DRAM2) U101.J6(NVCC_DRAM3) U101.K6(NVCC_DRAM4) U101.L6(NVCC_DRAM5) U101.M6(NVCC_DRAM6) U201.A1(VDDQ1) U201.A8(VDDQ2) U201.B2(VDD1) U201.C1(VDDQ3) U201.C9(VDDQ4) U201.D2(VDDQ5) U201.D9(VDD2) U201.E9(VDDQ6) U201.F1(VDDQ7) U201.G7(VDD3) U201.H2(VDDQ8) U201.H9(VDDQ9) U201.K2(VDD4) U201.K8(VDD5) U201.N1(VDD6) U201.N9(VDD7) U201.R1(VDD8) U201.R9(VDD9)
DRAM_VREF: C202.1 C203.1 C204.1 C222.2 C224.1 C2203.1 R207.2 R208.1 U101.P4(DRAM_VREF) U201.H1(VREFDQ) U201.M8(VREFCA)
GND: C201.2 C202.2 C203.2 C204.2 C205.2 C206.2 C207.2 C208.2 C209.2 C210.2 C211.2 C212.2 C213.2 C214.2 C215.2 C216.2 C217.2 C218.2 C219.2 C220.2 C221.2 C223.2 C224.2 C225.2 C226.2 C2203.2 R201.1 R202.2 R203.2 R204.1 R205.1 R208.2 R209.2 R2204.2 TP212.1(TP) TP214.1(TP) TP216.1(TP) U201.A9(VSS1) U201.B1(VSSQ1) U201.B3(VSS2) U201.B9(VSSQ2) U201.D1(VSSQ3) U201.D8(VSSQ4) U201.E1(VSS3) U201.E2(VSSQ5) U201.E8(VSSQ6) U201.F9(VSSQ7) U201.G1(VSSQ8) U201.G8(VSS4) U201.G9(VSSQ9) U201.J2(VSS5) U201.J8(VSS6) U201.M1(VSS7) U201.M9(VSS8) U201.P1(VSS9) U201.P9(VSS10) U201.T1(VSS11) U201.T9(VSS12)
VDD_HIGH_CAP: C201.1 U101.N6(NVCC_DRAM_2P5)
DRAM_ADDR0: TP207.1(Pin1) TP208.1(Pin1) U101.L5(DRAM_ADDR00) U201.N3(A0)
DRAM_ADDR1: U101.H2(DRAM_ADDR01) U201.P7(A1)
DRAM_ADDR2: U101.K1(DRAM_ADDR02) U201.P3(A2)
DRAM_ADDR3: U101.M2(DRAM_ADDR03) U201.N2(A3)
DRAM_ADDR4: U101.K4(DRAM_ADDR04) U201.P8(A4)
DRAM_ADDR5: U101.L1(DRAM_ADDR05) U201.P2(A5)
DRAM_ADDR6: U101.G2(DRAM_ADDR06) U201.R8(A6)
DRAM_ADDR7: U101.H4(DRAM_ADDR07) U201.R2(A7)
DRAM_ADDR8: U101.J4(DRAM_ADDR08) U201.T8(A8)
DRAM_ADDR9: U101.L2(DRAM_ADDR09) U201.R3(A9)
DRAM_ADDR10: U101.M4(DRAM_ADDR10) U201.L7(A10/AP)
DRAM_ADDR11: U101.K3(DRAM_ADDR11) U201.R7(A11)
DRAM_ADDR12: U101.L4(DRAM_ADDR12) U201.N7(A12/~{BC})
DRAM_ADDR13: U101.H3(DRAM_ADDR13) U201.T3(A13)
DRAM_ADDR14: U101.G1(DRAM_ADDR14) U201.T7(A14)
DRAM_ADDR15: U101.K5(DRAM_ADDR15) U201.M7(NC_M7)
DRAM_CAS_B: U101.J2(~{DRAM_CAS}) U201.K3(~{CAS})
DRAM_CS0_B: U101.N2(~{DRAM_CS0}) U201.L2(~{CS})
DRAM_CS1_B: U101.H5(~{DRAM_CS1}) U201.L1(NC_L1)
DRAM_DATA0: TP202.1(Pin1) TP204.1(Pin1) U101.T4(DRAM_DATA00) U201.E3(DQ0)
DRAM_DATA1: U101.U6(DRAM_DATA01) U201.H3(DQ4)
DRAM_DATA2: U101.T6(DRAM_DATA02) U201.H7(DQ7)
DRAM_DATA3: U101.U7(DRAM_DATA03) U201.F8(DQ3)
DRAM_DATA4: U101.U8(DRAM_DATA04) U201.F7(DQ1)
DRAM_DATA5: U101.T8(DRAM_DATA05) U201.H8(DQ5)
DRAM_DATA6: U101.T5(DRAM_DATA06) U201.G2(DQ6)
DRAM_DATA7: U101.U4(DRAM_DATA07) U201.F2(DQ2)
DRAM_DATA8: U101.U2(DRAM_DATA08) U201.D7(DQ8)
DRAM_DATA9: U101.U3(DRAM_DATA09) U201.C3(DQ9)
DRAM_DATA10: U101.U5(DRAM_DATA10) U201.C8(DQ10)
DRAM_DATA11: U101.R4(DRAM_DATA11) U201.C2(DQ11)
DRAM_DATA12: U101.P5(DRAM_DATA12) U201.A7(DQ12)
DRAM_DATA13: U101.P3(DRAM_DATA13) U201.A2(DQ13)
DRAM_DATA14: U101.R2(DRAM_DATA14) U201.B8(DQ14)
DRAM_DATA15: U101.R1(DRAM_DATA15) U201.A3(DQ15)
DRAM_DQM0: U101.T7(DRAM_DQM0) U201.E7(LDM)
DRAM_DQM1: U101.T3(DRAM_DQM1) U201.D3(UDM)
DRAM_ODT0: U101.N1(DRAM_ODT0) U201.K1(ODT)
DRAM_ODT1: U101.F1(DRAM_ODT1) U201.J1(NC_J1)
DRAM_RAS_B: U101.M5(~{DRAM_RAS}) U201.J3(~{RAS})
DRAM_RESET_B: R201.2 U101.G4(DRAM_RESET) U201.T2(~{RESET})
DRAM_SDBA0: U101.M1(DRAM_SDBA0) U201.M2(BA0)
DRAM_SDBA1: U101.H1(DRAM_SDBA1) U201.N8(BA1)
DRAM_SDBA2: U101.K2(DRAM_SDBA2) U201.M3(BA2)
DRAM_SDCKE0: R203.1 U101.M3(DRAM_SDCKE0) U201.K9(CKE)
DRAM_SDCKE1: R202.1 U101.J3(DRAM_SDCKE1) U201.J9(NC_J9)
DRAM_SDCLK0_N: R206.2 TP205.1(Pin1) TP206.1(Pin1) U101.P2(DRAM_SDCLK0_N) U201.K7(~{CK})
DRAM_SDCLK0_P: R206.1 TP201.1(Pin1) TP203.1(Pin1) U101.P1(DRAM_SDCLK0_P) U201.J7(CK)
DRAM_SDQS0_N: C227.2 C229.2 U101.P7(DRAM_SDQS0_N) U201.G3(~{LDQS})
DRAM_SDQS0_P: C227.1 C229.1 U101.P6(DRAM_SDQS0_P) U201.F3(LDQS)
DRAM_SDQS1_N: C228.2 C230.2 U101.T2(DRAM_SDQS1_N) U201.B7(~{UDQS})
DRAM_SDQS1_P: C228.1 C230.1 U101.T1(DRAM_SDQS1_P) U201.C7(UDQS)
DRAM_SDWE_B: U101.J1(~{DRAM_SDWE}) U201.L3(~{WE})
DRAM_ZQ0: R204.2 R2204.1 U201.L8(ZQ)
DRAM_ZQ1: R209.1 U201.L9(NC_L9)
ZQPAD: R205.2 U101.N4(DRAM_ZQPAD)

### Buses and harness runs
bus DRAM_ADDR[0..15]
bus DRAM_DATA[0..15]

### Notes on the sheet
- DDR3/LvDDR3
- (near U201) J1/J9/L1/L9 Reserved for Use with
  Twin-Die DDR3L
  Micron P/N: MT41K512M16TNA
- (near U201) 8Gb: MT41K512M16HA-125 IT
  4Gb: MT41K256M16TW-107:P
- Add 10uF
- Note:
  CLK termination: Place R206 close to U2.
- # Note: 1K/1.5K are OK
- # Note:
  Test points for signal integrity measurement
- (in symbol MCIMX6Y2DVM05AA_PBGA_289P, part C) i.MX6ULL - DDR
- (in symbol TitleBlock_FS) ICAP Classification:; CP:; IUO:; PUBI:; Drawing Title:; Page Title:; Size; Document Number; Rev; Date:; Sheet; of

### Library data of the parts
*#5 = TitleBlock_FS: as *#2 on sheet A-01 BLOCK DIAGRAM; FCP: ___; Page Create Date: March  8, 1995; Page Modify Date: *
C201 C204 C210 C217-C221 = CAP_NP: CAP CER 0.22UF 10V 10% X5R 0402; CLASS: DISCRETE; AGILE_PN: 150-77358; MFG_NAME01: MURATA; MFG_PN01: GRM155R61A224KE19B; CAD_APPROVED: Yes; FPLIST: CC0402_25,CC0402_HD,0402_CC; Tolerance: 10%; ROHS: Yes; HEIGHT: 0.55MM
C202 C203 C205-C209 C212-C216 C226 C2203 = CAP_NP: CAP CER 0.22UF 10V 10% X5R 0402; CLASS: DISCRETE; FPLIST: CC0402_25,CC0402_HD,0402_CC; CAD_APPROVED: Yes; MFG_PN01: GRM155R61A224KE19B; MFG_NAME01: MURATA; AGILE_PN: 150-77358; HEIGHT: 0.55MM; ROHS: Yes; Tolerance: 10%
C211 = CAP_NP: as C101 on sheet C-01 CPU PWR; VOLTAGE: 6.3V; HEIGHT: 1MM; ROHS: Yes; Tolerance: 20%
C222 C224 = CAP_NP: CAP CER 0.1UF 25V 10% X5R 0402; CLASS: DISCRETE; FPLIST: CC0402_25,CC0402_HD,0402_CC; CAD_APPROVED: Yes; MFG_PN01: CC0402KRX5R8BB104; MFG_NAME01: YAGEO AMERICA; AGILE_PN: 150-78633; HEIGHT: 0.55MM; ROHS: Yes; Tolerance: 10%
C223 = CAP_NP: CAP CER 4.7UF 6.3V 20% X5R 0402; CLASS: DISCRETE; AGILE_PN: 150-78463; MFG_NAME01: VENKEL COMPANY; MFG_PN01: C0402X5R6R3-475MNP; CAD_APPROVED: Yes; FPLIST: CC0402_25,CC0402_HD,0402_CC; VOLTAGE: 6.3V; Tolerance: 20%; ROHS: Yes; HEIGHT: 0.65MM
C225 = CAP_NP: CAP CER 10UF 10V 20% X5R 0603; CLASS: DISCRETE; AGILE_PN: 150-78609; MFG_NAME01: TAIYO YUDEN; MFG_PN01: LMK107BJ106MALTD; CAD_APPROVED: Yes; FPLIST: CC0603_OV,CC0603,0603_CC; ROHS: Yes; HEIGHT: 1.016MM
C227-C230 = CAP_NP: CAP CER 2.2pF 50V 0.25pF C0G 0402; CLASS: DISCRETE; PCB Footprint: 0402_CC; AGILE_PN: 150-79743; Tolerance: 11.36%; MFG_NAME01: MURATA; MFG_PN01: GRM1555C1H2R2CA01D; CAD_APPROVED: Yes; FPLIST: CC0402_25,CC0402_HD,0402_CC; ROHS: Yes; HEIGHT: 0.55MM; VOLTAGE: 50V
R201-R203 = RES: RES MF 10K 1/16W 5% 0402; CLASS: DISCRETE; PCB Footprint: 0402_CC; AGILE_PN: 470-75557; MFG_NAME01: VISHAY INTERTECHNOLOGY; MFG_PN01: CRCW040210K0JNED; CAD_APPROVED: Yes; FPLIST: RC0402_25,RC0402_HD,0402_CC; Tolerance: 5%; ROHS: Yes
R204 R209 R2204 = RES: RES MF 240 OHM 1/16W 1% 0402; CLASS: DISCRETE; FPLIST: RC0402_25,RC0402_HD,0402_CC; CAD_APPROVED: Yes; MFG_PN01: RK73H1ETTP2400F; MFG_NAME01: KOA SPEER; AGILE_PN: 470-30776; PCB Footprint: 0402_CC; ROHS: Yes
R205 = RES: RES MF 240 OHM 1/16W 1% 0402; CLASS: DISCRETE; PCB Footprint: 0402_CC; AGILE_PN: 470-30776; MFG_NAME01: KOA SPEER; MFG_PN01: RK73H1ETTP2400F; CAD_APPROVED: Yes; FPLIST: RC0402_25,RC0402_HD,0402_CC; ROHS: Yes
R206 = RES: RES MF 470 OHM 1/16W 5% 0402; CLASS: DISCRETE; PCB Footprint: 0402_CC; FPLIST: RC0402_25,RC0402_HD,0402_CC; CAD_APPROVED: Yes; MFG_PN01: RC73L2Z471JTF; MFG_NAME01: SMEC; AGILE_PN: 470-30315; ROHS: Yes; Tolerance: 5%
R207 R208 = RES: RES MF 1.5K 1/16W 1% 0402; CLASS: DISCRETE; PCB Footprint: 0402_CC; FPLIST: RC0402_25,RC0402_HD,0402_CC; CAD_APPROVED: Yes; MFG_PN01: CR0402-FX-1501GLF; MFG_NAME01: BOURNS; AGILE_PN: 470-80487; ROHS: Yes
TP201 TP203 = TESTLOOP: TEST POINT PAD 15MIL DIA SMT, NO PART TO ORDER; CLASS: IO; AGILE_PN: 211-76645; MFG_NAME01: NOTACOMPONENT; CAD_APPROVED: Yes; MFG_PN01: NOTACOMPONENT; ROHS: Yes; HEIGHT: 0.1MM; PCB Footprint: TPAD_015
TP202 TP204-TP208 = TESTLOOP: TEST POINT PAD 15MIL DIA SMT, NO PART TO ORDER; CLASS: IO; CAD_APPROVED: Yes; MFG_PN01: NOTACOMPONENT; AGILE_PN: 211-76645; HEIGHT: 0.1MM; ROHS: Yes; MFG_NAME01: NOTACOMPONENT; PCB Footprint: TPAD_015
TP212 = T POINT R: TEST POINT PAD .035 SMT, no part to order; CLASS: IC; AGILE_PN: 510-75618; CAD_APPROVED: Yes; PCB Footprint: testpoint_35mil; ROHS: Yes; HEIGHT: 0.1MM
TP214 TP216 = T POINT R: TEST POINT PAD .035 SMT, no part to order; CLASS: IC; CAD_APPROVED: Yes; AGILE_PN: 510-75618; PCB Footprint: testpoint_35mil; HEIGHT: 0.1MM; ROHS: Yes
U101 = MCIMX6Y2DVM05AA_PBGA_289P: CLASS: IC
U201 = MT41J256M16RE_FBGA96: CLASS: IC

## Sheet C-03 eMMC_NAND_TF_QSPI.SchDoc
size 513 x 386 mm
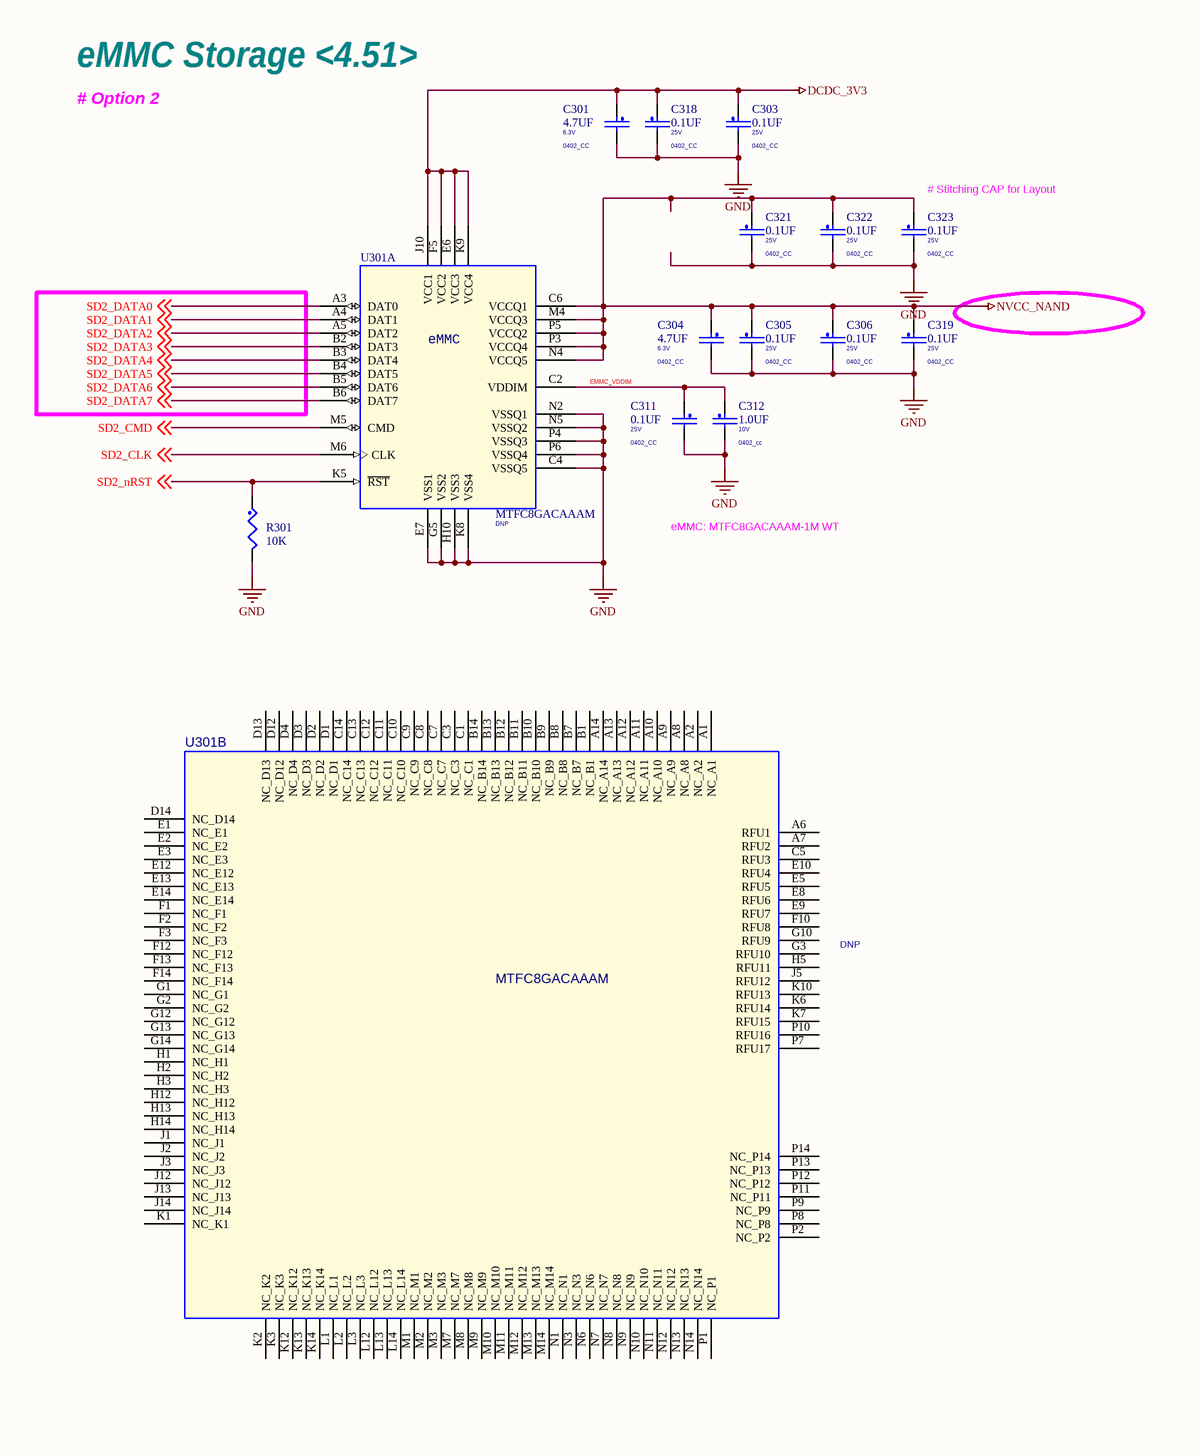
[diagram p8: C-03 eMMC_NAND_TF_QSPI.SchDoc, left]
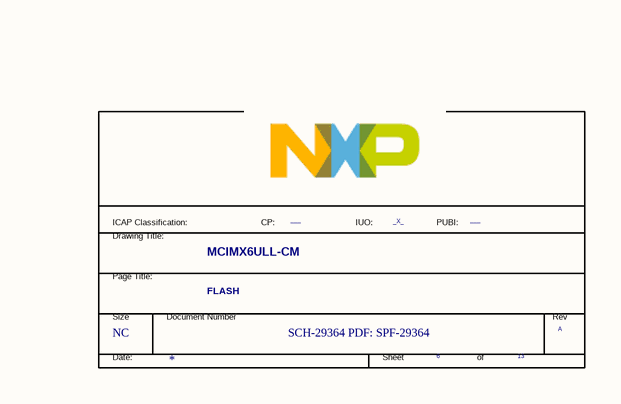
[diagram p9: C-03 eMMC_NAND_TF_QSPI.SchDoc, right]

### Parts
(Parts that share a designator on the sheet are numbered #1, #2 ... from top to bottom, then left to right.)
*#6  FIUO: _X_  PUBI: ___  Doc: SCH-29364 PDF: SPF-29364  RevCode: A  Title: MCIMX6ULL-CM  Page Size: NC  Page Number: 6  Page Count: 13  PageTitle: FLASH  (hidden comment: TitleBlock_FS)  (graphical)
C301  4.7UF  PCB Footprint: 0402_CC  voltage rating: 6.3V  [C0402_H0.5mm]
C303  0.1UF  VOLTAGE: 25V  PCB Footprint: 0402_CC  [C0402_H0.5mm]
C304  4.7UF  voltage rating: 6.3V  PCB Footprint: 0402_CC  [C0402_H0.5mm]
C305  0.1UF  VOLTAGE: 25V  PCB Footprint: 0402_CC  [C0402_H0.5mm]
C306  0.1UF  VOLTAGE: 25V  PCB Footprint: 0402_CC  [C0402_H0.5mm]
C311  0.1UF  VOLTAGE: 25V  PCB Footprint: 0402_CC  [C0402_H0.5mm]
C312  1.0UF  VOLTAGE: 10V  PCB Footprint: 0402_cc  [C0402_H0.5mm]
C318  0.1UF  VOLTAGE: 25V  PCB Footprint: 0402_CC  [C0402_H0.5mm]
C319  0.1UF  VOLTAGE: 25V  PCB Footprint: 0402_CC  [C0402_H0.5mm]
C321  0.1UF  VOLTAGE: 25V  PCB Footprint: 0402_CC  [C0402_H0.5mm]
C322  0.1UF  VOLTAGE: 25V  PCB Footprint: 0402_CC  [C0402_H0.5mm]
C323  0.1UF  VOLTAGE: 25V  PCB Footprint: 0402_CC  [C0402_H0.5mm]
R301  10K  [R0402_H0.35mm]
U301  MTFC8GACAAAM  ASSY_OPT: DNP  [BGA153_11.5x13mm]  (parts A,B of 2)

### Nets
DCDC_3V3: C301.1 C303.1 C318.1 U301.E6(VCC3) U301.F5(VCC2) U301.J10(VCC1) U301.K9(VCC4)  [project net NVCC_3V3]
GND: C301.2 C303.2 C304.2 C305.2 C306.2 C311.2 C312.2 C318.2 C319.2 C321.2 C322.2 C323.2 R301.2 U301.C4(VSSQ5) U301.E7(VSS1) U301.G5(VSS2) U301.H10(VSS3) U301.K8(VSS4) U301.N2(VSSQ1) U301.N5(VSSQ2) U301.P4(VSSQ3) U301.P6(VSSQ4)
NVCC_NAND: C304.1 C305.1 C306.1 C319.1 C321.1 C322.1 C323.1 U301.C6(VCCQ1) U301.M4(VCCQ3) U301.N4(VCCQ5) U301.P3(VCCQ4) U301.P5(VCCQ2)
EMMC_VDDIM: C311.1 C312.1 U301.C2(VDDIM)
SD2_CLK: U301.M6(CLK) ; off-sheet SD2_CLK  [project net NAND_nRE]
SD2_CMD: U301.M5(CMD) ; off-sheet SD2_CMD  [project net NAND_nWE]
SD2_DATA0: U301.A3(DAT0) ; off-sheet SD2_DATA0  [project net NAND_DATA0]
SD2_DATA1: U301.A4(DAT1) ; off-sheet SD2_DATA1  [project net NAND_DATA1]
SD2_DATA2: U301.A5(DAT2) ; off-sheet SD2_DATA2  [project net NAND_DATA2]
SD2_DATA3: U301.B2(DAT3) ; off-sheet SD2_DATA3  [project net NAND_DATA3]
SD2_DATA4: U301.B3(DAT4) ; off-sheet SD2_DATA4  [project net NAND_DATA4]
SD2_DATA5: U301.B4(DAT5) ; off-sheet SD2_DATA5  [project net NAND_DATA5]
SD2_DATA6: U301.B5(DAT6) ; off-sheet SD2_DATA6  [project net NAND_DATA6]
SD2_DATA7: U301.B6(DAT7) ; off-sheet SD2_DATA7  [project net NAND_DATA7]
SD2_nRST: R301.1 U301.K5(~{RST}) ; off-sheet SD2_nRST  [project net NAND_ALE]

Not connected (* = marked no-connect by the designer): U301 A1(NC_A1) A2(NC_A2) A6(RFU1) A7(RFU2) A8(NC_A8) A9(NC_A9) A10(NC_A10) A11(NC_A11) A12(NC_A12) A13(NC_A13) A14(NC_A14) B1(NC_B1) B7(NC_B7) B8(NC_B8) B9(NC_B9) B10(NC_B10) B11(NC_B11) B12(NC_B12) B13(NC_B13) B14(NC_B14) C1(NC_C1) C3(NC_C3) C5(RFU3) C7(NC_C7) C8(NC_C8) C9(NC_C9) C10(NC_C10) C11(NC_C11) C12(NC_C12) C13(NC_C13) C14(NC_C14) D1(NC_D1) D2(NC_D2) D3(NC_D3) D4(NC_D4) D12(NC_D12) D13(NC_D13) D14(NC_D14) E1(NC_E1) E2(NC_E2) E3(NC_E3) E5(RFU5) E8(RFU6) E9(RFU7) E10(RFU4) E12(NC_E12) E13(NC_E13) E14(NC_E14) F1(NC_F1) F2(NC_F2) F3(NC_F3) F10(RFU8) F12(NC_F12) F13(NC_F13) F14(NC_F14) G1(NC_G1) G2(NC_G2) G3(RFU10) G10(RFU9) G12(NC_G12) G13(NC_G13) G14(NC_G14) H1(NC_H1) H2(NC_H2) H3(NC_H3) H5(RFU11) H12(NC_H12) H13(NC_H13) H14(NC_H14) J1(NC_J1) J2(NC_J2) J3(NC_J3) J5(RFU12) J12(NC_J12) J13(NC_J13) J14(NC_J14) K1(NC_K1) K2(NC_K2) K3(NC_K3) K6(RFU14) K7(RFU15) K10(RFU13) K12(NC_K12) K13(NC_K13) K14(NC_K14) L1(NC_L1) L2(NC_L2) L3(NC_L3) L12(NC_L12) L13(NC_L13) L14(NC_L14) M1(NC_M1) M2(NC_M2) M3(NC_M3) M7(NC_M7) M8(NC_M8) M9(NC_M9) M10(NC_M10) M11(NC_M11) M12(NC_M12) M13(NC_M13) M14(NC_M14) N1(NC_N1) N3(NC_N3) N6(NC_N6) N7(NC_N7) N8(NC_N8) N9(NC_N9) N10(NC_N10) N11(NC_N11) N12(NC_N12) N13(NC_N13) N14(NC_N14) P1(NC_P1) P2(NC_P2) P7(RFU17) P8(NC_P8) P9(NC_P9) P10(RFU16) P11(NC_P11) P12(NC_P12) P13(NC_P13) P14(NC_P14)

### Notes on the sheet
- eMMC Storage <4.51>
- # Option 2
- (near C323) # Stitching CAP for Layout
- eMMC: MTFC8GACAAAM-1M WT
- (in symbol MTFC4GMVEA_WFBGA_153P, part A) eMMC
- (in symbol TitleBlock_FS) ICAP Classification:; CP:; IUO:; PUBI:; Drawing Title:; Page Title:; Size; Document Number; Rev; Date:; Sheet; of

### Library data of the parts
*#6 = TitleBlock_FS: as *#3 on sheet A-02 PWR TREE; FCP: ___; Page Create Date: March  8, 1995; Page Modify Date: *
C301 = CAP_NP: as C223 on sheet C-02 LvDDR3; VOLTAGE: 6.3V; Tolerance: 20%; ROHS: Yes; HEIGHT: 0.65MM
C303 C319 C321 = CAP_NP: CAP CER 0.1UF 25V 10% X5R 0402; CLASS: DISCRETE; AGILE_PN: 150-78633; MFG_NAME01: YAGEO AMERICA; MFG_PN01: CC0402KRX5R8BB104; CAD_APPROVED: Yes; FPLIST: CC0402_25,CC0402_HD,0402_CC; Tolerance: 10%; ROHS: Yes; HEIGHT: 0.55MM
C304 = CAP_NP: as C107 on sheet C-01 CPU PWR; HEIGHT: 0.65MM; ROHS: Yes; Tolerance: 20%; VOLTAGE: 6.3V
C305 C306 C311 C318 C322 C323 = CAP_NP: as C222 on sheet C-02 LvDDR3; HEIGHT: 0.55MM; ROHS: Yes; Tolerance: 10%
C312 = CAP_NP: CAP CER 1.0UF 10V 10% X5R 0402; CLASS: DISCRETE; FPLIST: CC0402_25,CC0402_HD,0402_CC; CAD_APPROVED: Yes; MFG_PN01: CC0402KRX5R6BB105; MFG_NAME01: YAGEO AMERICA; AGILE_PN: 150-75772; HEIGHT: 0.6MM; ROHS: Yes
R301 = RES: RES MF 10K 1/16W 5% 0402; CLASS: DISCRETE; PCB Footprint: 0402_CC; FPLIST: RC0402_25,RC0402_HD,0402_CC; CAD_APPROVED: Yes; MFG_PN01: CRCW040210K0JNED; MFG_NAME01: VISHAY INTERTECHNOLOGY; AGILE_PN: 470-75557; ROHS: Yes; Tolerance: 5%; TOL: 5%; HEIGHT: 0.4 MM
U301 = MTFC4GMVEA_WFBGA_153P: IC MEM NAND FLASH 8GB MMC 4.51 CTLR 2.7-3.6V FBGA153; PCB Footprint: FBGA153_0P5_11P5X13; AGILE_PN: 342-00603; MFG_NAME01: MICRON; MFG_PN01: MTFC8GACAAAM-1M WT; CAD_APPROVED: Yes; CLASS: IC; ROHS: Yes; HEIGHT: 1.165 MM

## Sheet C-04 CPU PERI1.SchDoc
size 513 x 386 mm
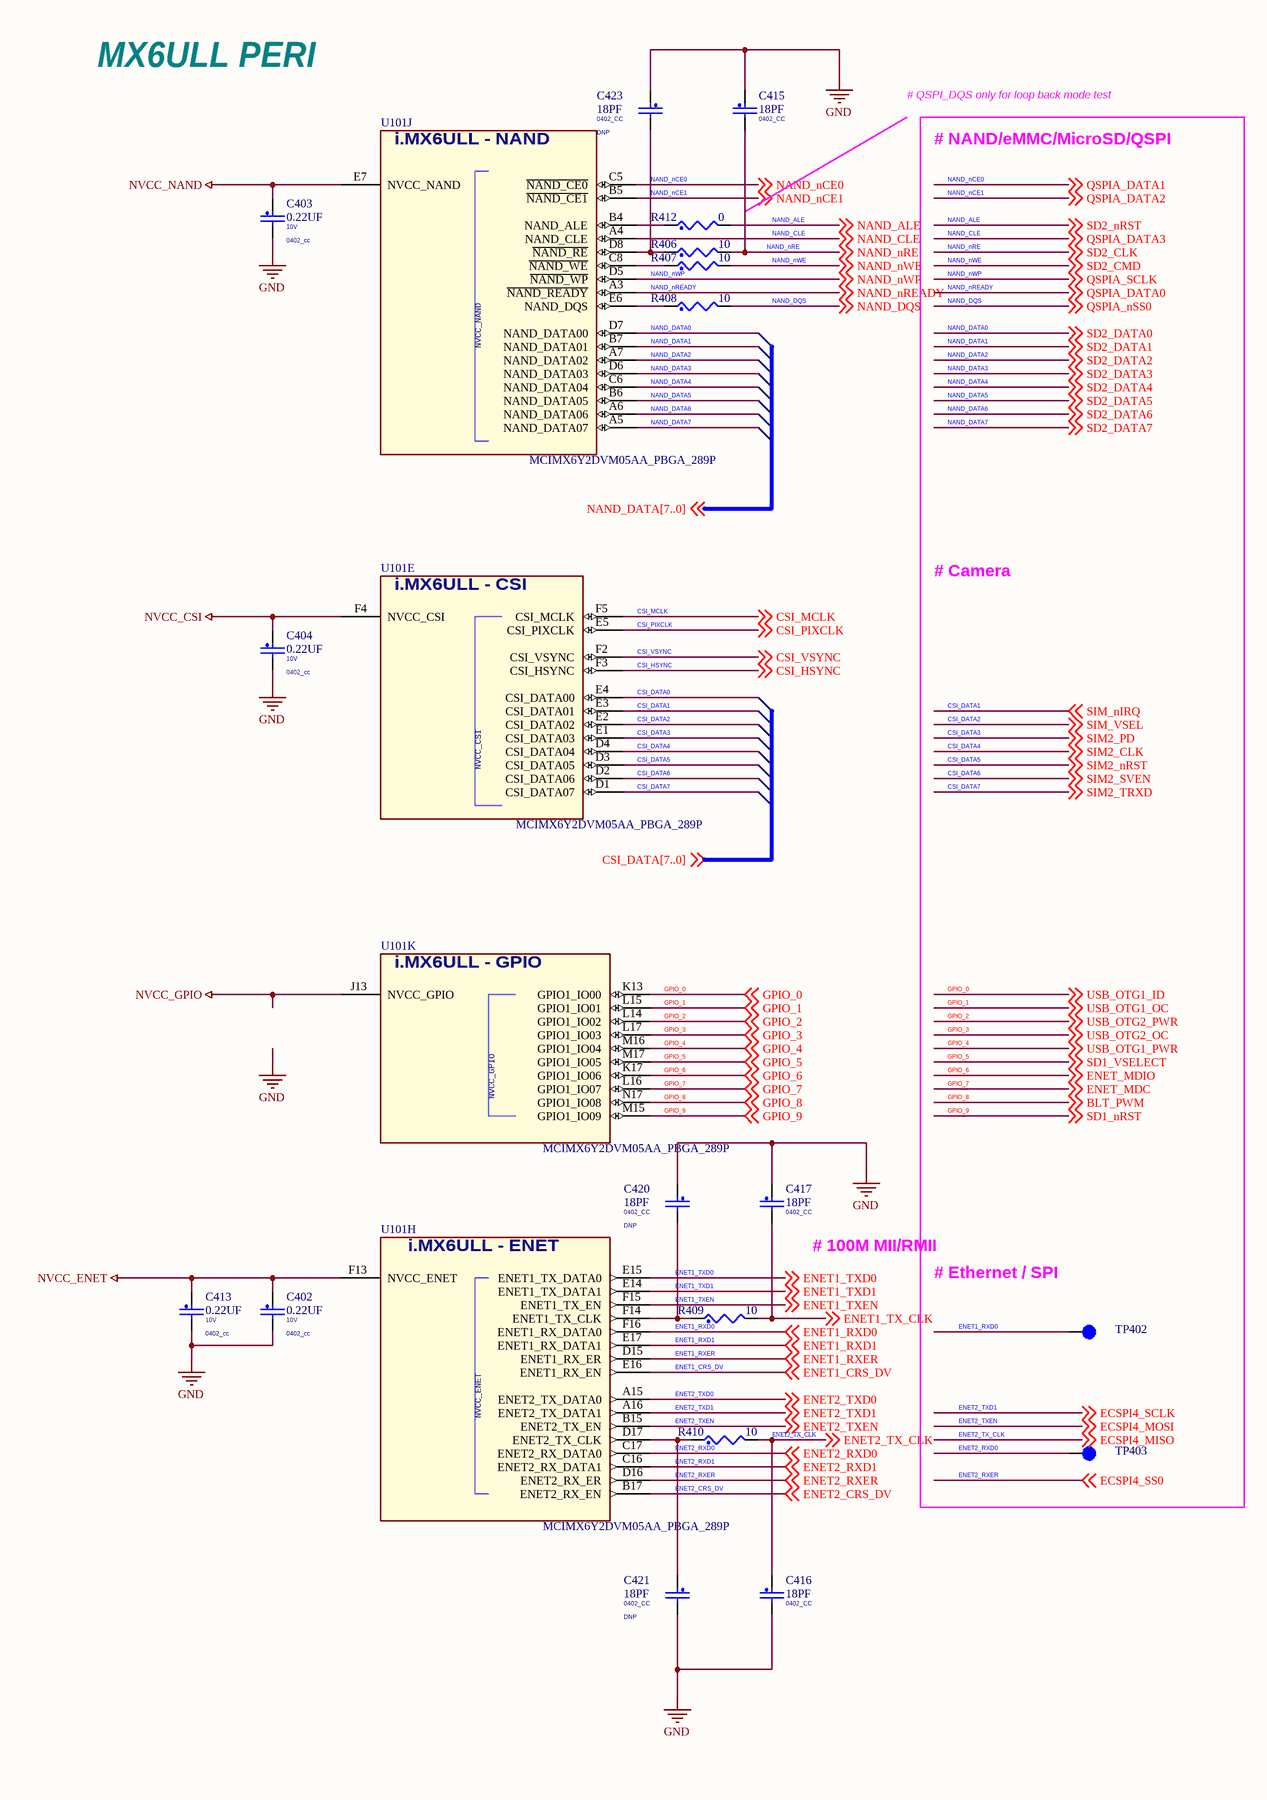
[diagram p10: C-04 CPU PERI1.SchDoc, left]
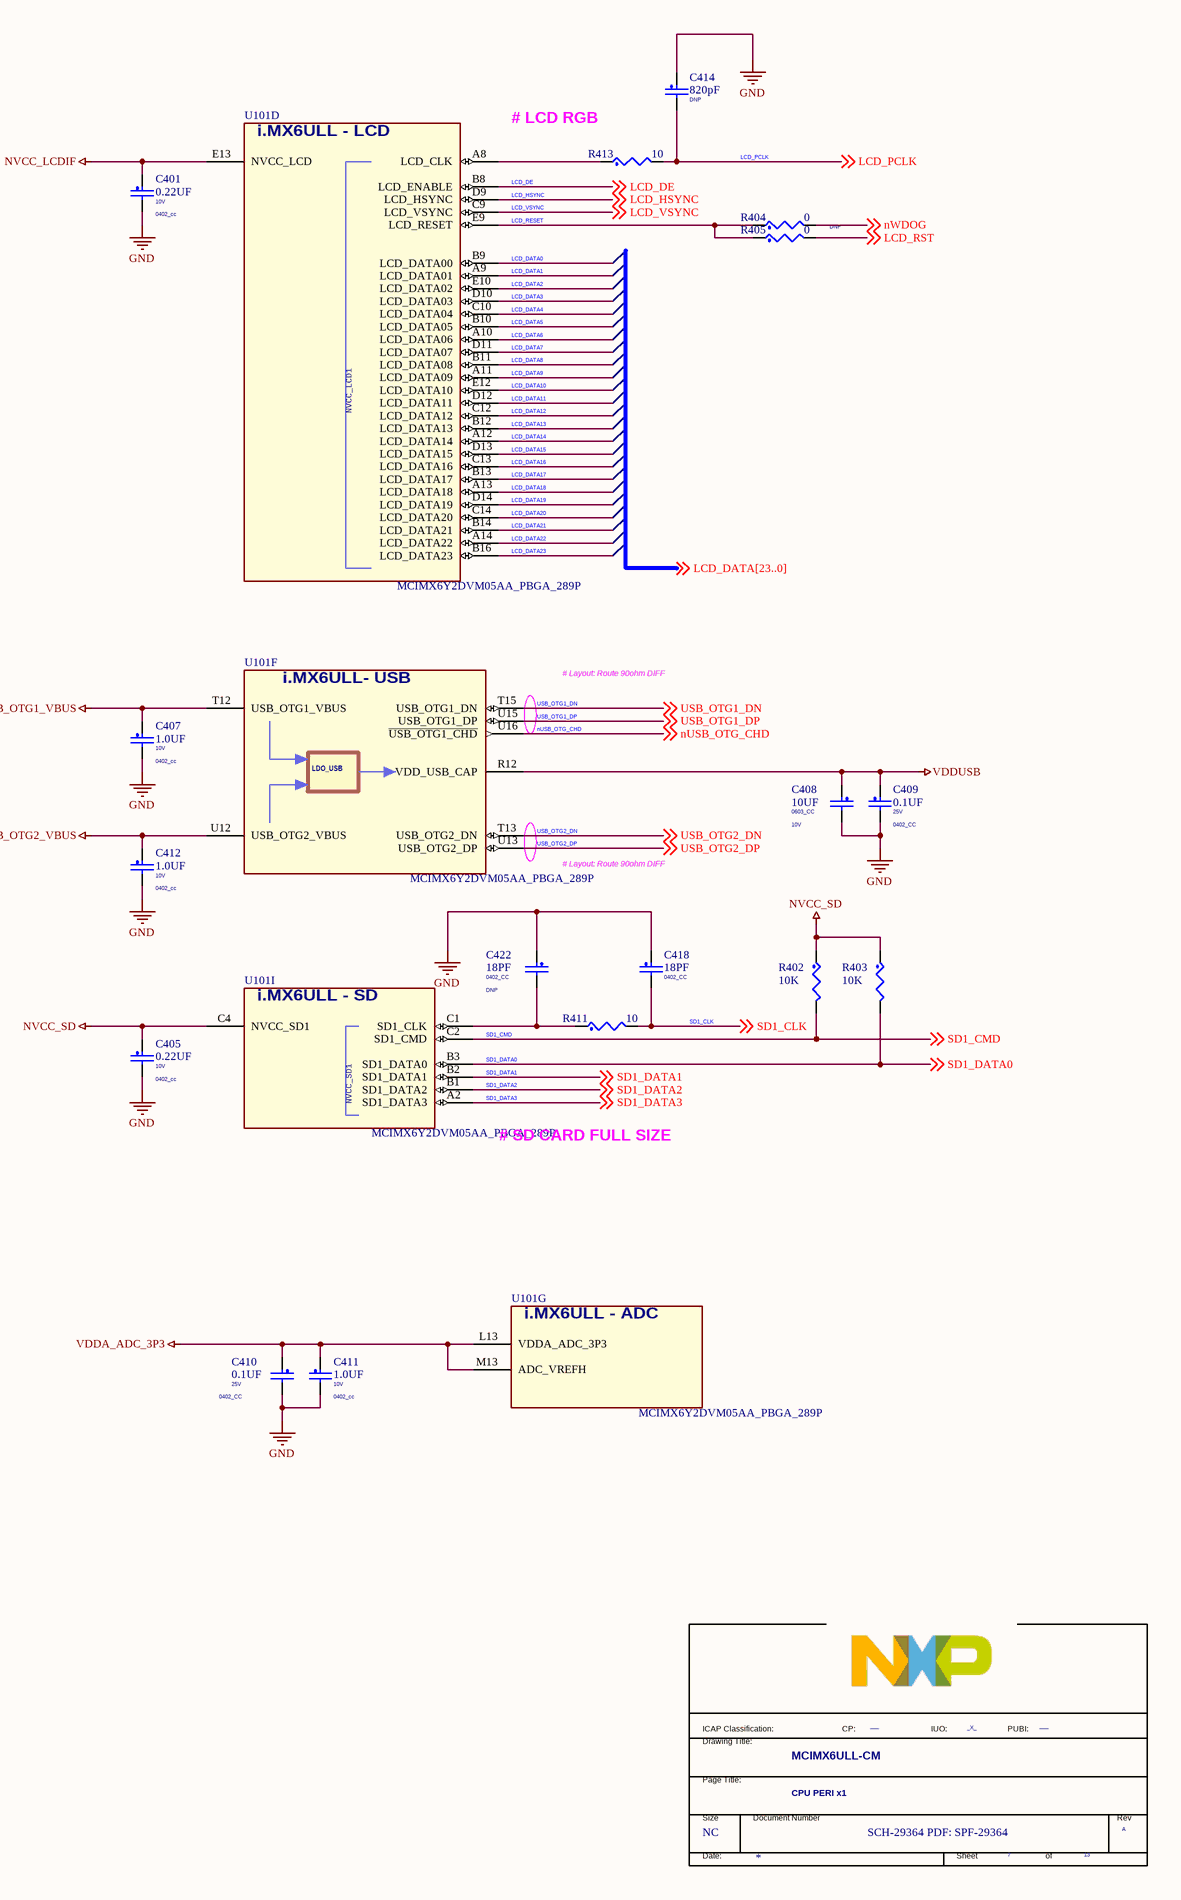
[diagram p11: C-04 CPU PERI1.SchDoc, right]

### Parts
(Parts that share a designator on the sheet are numbered #1, #2 ... from top to bottom, then left to right.)
*#7  FIUO: _X_  PUBI: ___  Doc: SCH-29364 PDF: SPF-29364  RevCode: A  Title: MCIMX6ULL-CM  Page Size: NC  Page Number: 7  Page Count: 13  PageTitle: CPU PERI x1  (hidden comment: TitleBlock_FS)  (graphical)
C401  0.22UF  VOLTAGE: 10V  PCB Footprint: 0402_cc  [C0402_H0.5mm]
C402  0.22UF  VOLTAGE: 10V  PCB Footprint: 0402_cc  [C0402_H0.5mm]
C403  0.22UF  VOLTAGE: 10V  PCB Footprint: 0402_cc  [C0402_H0.5mm]
C404  0.22UF  PCB Footprint: 0402_cc  VOLTAGE: 10V  [C0402_H0.5mm]
C405  0.22UF  VOLTAGE: 10V  PCB Footprint: 0402_cc  [C0402_H0.5mm]
C407  1.0UF  VOLTAGE: 10V  PCB Footprint: 0402_cc  [C0402_H0.5mm]
C408  10UF  VOLTAGE: 10V  PCB Footprint: 0603_CC  [C0603_H0.8mm]
C409  0.1UF  VOLTAGE: 25V  PCB Footprint: 0402_CC  [C0402_H0.5mm]
C410  0.1UF  VOLTAGE: 25V  PCB Footprint: 0402_CC  [C0402_H0.5mm]
C411  1.0UF  PCB Footprint: 0402_cc  VOLTAGE: 10V  [C0402_H0.5mm]
C412  1.0UF  VOLTAGE: 10V  PCB Footprint: 0402_cc  [C0402_H0.5mm]
C413  0.22UF  PCB Footprint: 0402_cc  VOLTAGE: 10V  [C0402_H0.5mm]
C414  820pF  ASSY_OPT: DNP  [C0402_H0.5mm]
C415  18PF  PCB Footprint: 0402_CC  [C0402_H0.5mm]
C416  18PF  PCB Footprint: 0402_CC  [C0402_H0.5mm]
C417  18PF  PCB Footprint: 0402_CC  [C0402_H0.5mm]
C418  18PF  PCB Footprint: 0402_CC  [C0402_H0.5mm]
C420  18PF  ASSY_OPT: DNP  PCB Footprint: 0402_CC  [C0402_H0.5mm]
C421  18PF  ASSY_OPT: DNP  PCB Footprint: 0402_CC  [C0402_H0.5mm]
C422  18PF  ASSY_OPT: DNP  PCB Footprint: 0402_CC  [C0402_H0.5mm]
C423  18PF  PCB Footprint: 0402_CC  ASSY_OPT: DNP  [C0402_H0.5mm]
R402  10K  [R0402_H0.35mm]
R403  10K  [R0402_H0.35mm]
R404  0  [R0402_H0.35mm]
R405  0  ASSY_OPT: DNP  [R0402_H0.35mm]
R406  10  [R0402_H0.35mm]
R407  10  [R0402_H0.35mm]
R408  10  [R0402_H0.35mm]
R409  10  [R0402_H0.35mm]
R410  10  [R0402_H0.35mm]
R411  10  [R0402_H0.35mm]
R412  0  [R0402_H0.35mm]
R413  10  [R0402_H0.35mm]
TP402  TPAD_015  [TPAD_015]  (value not drawn)
TP403  TPAD_015  [TPAD_015]  (value not drawn)
U101  MCIMX6Y2DVM05AA_PBGA_289P  [BGA289_14x14mm]  (parts D,E,F,G,H,I,J,K of 11)

### Nets
GND: C401.2 C402.2 C403.2 C404.2 C405.2 C407.2 C408.2 C409.2 C410.2 C411.2 C412.2 C413.2 C414.1 C415.1 C416.2 C417.1 C418.1 C420.1 C421.2 C422.1 C423.1
NVCC_CSI: C404.1 U101.F4(NVCC_CSI)
NVCC_ENET: C401.1 C402.1 C413.1 U101.E13(NVCC_LCD) U101.F13(NVCC_ENET) U101.J13(NVCC_GPIO)  [also labelled NVCC_GPIO, NVCC_LCDIF]  [project net NVCC_3V3]
NVCC_NAND: C403.1 U101.E7(NVCC_NAND)
NVCC_SD: C405.1 R402.1 R403.1 U101.C4(NVCC_SD1)
USB_OTG1_VBUS: C407.1 U101.T12(USB_OTG1_VBUS)
USB_OTG2_VBUS: C412.1 U101.U12(USB_OTG2_VBUS)
VDDA_ADC_3P3: C410.1 C411.1 U101.L13(VDDA_ADC_3P3) U101.M13(ADC_VREFH)
VDDUSB: C408.1 C409.1 U101.R12(VDD_USB_CAP)
CSI_DATA0: U101.E4(CSI_DATA00)
CSI_DATA1: U101.E3(CSI_DATA01) ; off-sheet SIM_nIRQ  [also labelled SIM_nIRQ]
CSI_DATA2: U101.E2(CSI_DATA02) ; off-sheet SIM_VSEL  [also labelled SIM_VSEL]
CSI_DATA3: U101.E1(CSI_DATA03) ; off-sheet SIM2_PD  [also labelled SIM2_PD]
CSI_DATA4: U101.D4(CSI_DATA04) ; off-sheet SIM2_CLK  [also labelled SIM2_CLK]
CSI_DATA5: U101.D3(CSI_DATA05) ; off-sheet SIM2_nRST  [also labelled SIM2_nRST]
CSI_DATA6: U101.D2(CSI_DATA06) ; off-sheet SIM2_SVEN  [also labelled SIM2_SVEN]
CSI_DATA7: U101.D1(CSI_DATA07) ; off-sheet SIM2_TRXD  [also labelled SIM2_TRXD]
CSI_HSYNC: U101.F3(CSI_HSYNC) ; off-sheet CSI_HSYNC
CSI_MCLK: U101.F5(CSI_MCLK) ; off-sheet CSI_MCLK
CSI_PIXCLK: U101.E5(CSI_PIXCLK) ; off-sheet CSI_PIXCLK
CSI_VSYNC: U101.F2(CSI_VSYNC) ; off-sheet CSI_VSYNC
ENET1_CRS_DV: U101.E16(ENET1_RX_EN) ; off-sheet ENET1_CRS_DV
ENET1_RXD0: TP402.1(Pin1) U101.F16(ENET1_RX_DATA0) ; off-sheet ENET1_RXD0
ENET1_RXD1: U101.E17(ENET1_RX_DATA1) ; off-sheet ENET1_RXD1
ENET1_RXER: U101.D15(ENET1_RX_ER) ; off-sheet ENET1_RXER
ENET1_TX_CLK: C417.2 R409.2 ; off-sheet ENET1_TX_CLK
ENET1_TXD0: U101.E15(ENET1_TX_DATA0) ; off-sheet ENET1_TXD0
ENET1_TXD1: U101.E14(ENET1_TX_DATA1) ; off-sheet ENET1_TXD1
ENET1_TXEN: U101.F15(ENET1_TX_EN) ; off-sheet ENET1_TXEN
ENET2_CRS_DV: U101.B17(ENET2_RX_EN) ; off-sheet ENET2_CRS_DV
ENET2_RXD0: TP403.1(Pin1) U101.C17(ENET2_RX_DATA0) ; off-sheet ENET2_RXD0
ENET2_RXD1: U101.C16(ENET2_RX_DATA1) ; off-sheet ENET2_RXD1
ENET2_RXER: U101.D16(ENET2_RX_ER) ; off-sheet ENET2_RXER, off-sheet ECSPI4_SS0  [also labelled ECSPI4_SS0]
ENET2_TX_CLK: C416.1 R410.2 ; off-sheet ENET2_TX_CLK, off-sheet ECSPI4_MISO  [also labelled ECSPI4_MISO]
ENET2_TXD0: U101.A15(ENET2_TX_DATA0) ; off-sheet ENET2_TXD0
ENET2_TXD1: U101.A16(ENET2_TX_DATA1) ; off-sheet ENET2_TXD1, off-sheet ECSPI4_SCLK  [also labelled ECSPI4_SCLK]
ENET2_TXEN: U101.B15(ENET2_TX_EN) ; off-sheet ENET2_TXEN, off-sheet ECSPI4_MOSI  [also labelled ECSPI4_MOSI]
GPIO_0: U101.K13(GPIO1_IO00) ; off-sheet GPIO_0, off-sheet USB_OTG1_ID  [also labelled USB_OTG1_ID]
GPIO_1: U101.L15(GPIO1_IO01) ; off-sheet GPIO_1, off-sheet USB_OTG1_OC  [also labelled USB_OTG1_OC]
GPIO_2: U101.L14(GPIO1_IO02) ; off-sheet GPIO_2, off-sheet USB_OTG2_PWR  [also labelled USB_OTG2_PWR]
GPIO_3: U101.L17(GPIO1_IO03) ; off-sheet GPIO_3, off-sheet USB_OTG2_OC  [also labelled USB_OTG2_OC]
GPIO_4: U101.M16(GPIO1_IO04) ; off-sheet GPIO_4, off-sheet USB_OTG1_PWR  [also labelled USB_OTG1_PWR]
GPIO_5: U101.M17(GPIO1_IO05) ; off-sheet SD1_VSELECT, off-sheet GPIO_5  [also labelled SD1_VSELECT]
GPIO_6: U101.K17(GPIO1_IO06) ; off-sheet ENET_MDIO, off-sheet GPIO_6  [also labelled ENET_MDIO]
GPIO_7: U101.L16(GPIO1_IO07) ; off-sheet ENET_MDC, off-sheet GPIO_7  [also labelled ENET_MDC]
GPIO_8: U101.N17(GPIO1_IO08) ; off-sheet BLT_PWM, off-sheet GPIO_8  [also labelled BLT_PWM]
GPIO_9: U101.M15(GPIO1_IO09) ; off-sheet SD1_nRST, off-sheet GPIO_9  [also labelled SD1_nRST]
LCD_DATA0: U101.B9(LCD_DATA00)
LCD_DATA1: U101.A9(LCD_DATA01)
LCD_DATA2: U101.E10(LCD_DATA02)
LCD_DATA3: U101.D10(LCD_DATA03)
LCD_DATA4: U101.C10(LCD_DATA04)
LCD_DATA5: U101.B10(LCD_DATA05)
LCD_DATA6: U101.A10(LCD_DATA06)
LCD_DATA7: U101.D11(LCD_DATA07)
LCD_DATA8: U101.B11(LCD_DATA08)
LCD_DATA9: U101.A11(LCD_DATA09)
LCD_DATA10: U101.E12(LCD_DATA10)
LCD_DATA11: U101.D12(LCD_DATA11)
LCD_DATA12: U101.C12(LCD_DATA12)
LCD_DATA13: U101.B12(LCD_DATA13)
LCD_DATA14: U101.A12(LCD_DATA14)
LCD_DATA15: U101.D13(LCD_DATA15)
LCD_DATA16: U101.C13(LCD_DATA16)
LCD_DATA17: U101.B13(LCD_DATA17)
LCD_DATA18: U101.A13(LCD_DATA18)
LCD_DATA19: U101.D14(LCD_DATA19)
LCD_DATA20: U101.C14(LCD_DATA20)
LCD_DATA21: U101.B14(LCD_DATA21)
LCD_DATA22: U101.A14(LCD_DATA22)
LCD_DATA23: U101.B16(LCD_DATA23)
LCD_DE: U101.B8(LCD_ENABLE) ; off-sheet LCD_DE
LCD_HSYNC: U101.D9(LCD_HSYNC) ; off-sheet LCD_HSYNC
LCD_PCLK: C414.2 R413.2 ; off-sheet LCD_PCLK
LCD_RESET: R404.1 R405.1 U101.E9(LCD_RESET)
LCD_RST: R405.2 ; off-sheet LCD_RST
LCD_VSYNC: U101.C9(LCD_VSYNC) ; off-sheet LCD_VSYNC
NAND_ALE: R412.2 ; off-sheet NAND_ALE, off-sheet SD2_nRST  [also labelled SD2_nRST]
NAND_CLE: U101.A4(NAND_CLE) ; off-sheet NAND_CLE, off-sheet QSPIA_DATA3  [also labelled QSPIA_DATA3]
NAND_DATA0: U101.D7(NAND_DATA00) ; off-sheet SD2_DATA0  [also labelled SD2_DATA0]
NAND_DATA1: U101.B7(NAND_DATA01) ; off-sheet SD2_DATA1  [also labelled SD2_DATA1]
NAND_DATA2: U101.A7(NAND_DATA02) ; off-sheet SD2_DATA2  [also labelled SD2_DATA2]
NAND_DATA3: U101.D6(NAND_DATA03) ; off-sheet SD2_DATA3  [also labelled SD2_DATA3]
NAND_DATA4: U101.C6(NAND_DATA04) ; off-sheet SD2_DATA4  [also labelled SD2_DATA4]
NAND_DATA5: U101.B6(NAND_DATA05) ; off-sheet SD2_DATA5  [also labelled SD2_DATA5]
NAND_DATA6: U101.A6(NAND_DATA06) ; off-sheet SD2_DATA6  [also labelled SD2_DATA6]
NAND_DATA7: U101.A5(NAND_DATA07) ; off-sheet SD2_DATA7  [also labelled SD2_DATA7]
NAND_DQS: R408.2 ; off-sheet NAND_DQS, off-sheet QSPIA_nSS0  [also labelled QSPIA_nSS0]
NAND_nCE0: C423.2 R406.1 U101.B5(~{NAND_CE1}) U101.C5(~{NAND_CE0}) U101.D8(~{NAND_RE}) ; off-sheet NAND_nCE0, off-sheet NAND_nCE1, off-sheet QSPIA_DATA1, off-sheet QSPIA_DATA2  [also labelled NAND_nCE1, QSPIA_DATA1, QSPIA_DATA2]
NAND_nRE: C415.2 R406.2 ; off-sheet NAND_nRE, off-sheet SD2_CLK  [also labelled SD2_CLK]
NAND_nREADY: U101.A3(~{NAND_READY}) ; off-sheet NAND_nREADY, off-sheet QSPIA_DATA0  [also labelled QSPIA_DATA0]
NAND_nWE: R407.2 ; off-sheet NAND_nWE, off-sheet SD2_CMD  [also labelled SD2_CMD]
NAND_nWP: U101.D5(~{NAND_WP}) ; off-sheet NAND_nWP, off-sheet QSPIA_SCLK  [also labelled QSPIA_SCLK]
nUSB_OTG_CHD: U101.U16(~{USB_OTG1_CHD}) ; off-sheet nUSB_OTG_CHD
nWDOG: R404.2 ; off-sheet nWDOG
SD1_CLK: C418.2 R411.2 ; off-sheet SD1_CLK
SD1_CMD: R402.2 U101.C2(SD1_CMD) ; off-sheet SD1_CMD
SD1_DATA0: R403.2 U101.B3(SD1_DATA0) ; off-sheet SD1_DATA0
SD1_DATA1: U101.B2(SD1_DATA1) ; off-sheet SD1_DATA1
SD1_DATA2: U101.B1(SD1_DATA2) ; off-sheet SD1_DATA2
SD1_DATA3: U101.A2(SD1_DATA3) ; off-sheet SD1_DATA3
USB_OTG1_DN: U101.T15(USB_OTG1_DN) ; off-sheet USB_OTG1_DN
USB_OTG1_DP: U101.U15(USB_OTG1_DP) ; off-sheet USB_OTG1_DP
USB_OTG2_DN: U101.T13(USB_OTG2_DN) ; off-sheet USB_OTG2_DN
USB_OTG2_DP: U101.U13(USB_OTG2_DP) ; off-sheet USB_OTG2_DP
NetC420_2: C420.2 R409.1 U101.F14(ENET1_TX_CLK)
NetC421_1: C421.1 R410.1 U101.D17(ENET2_TX_CLK)
NetC422_2: C422.2 R411.1 U101.C1(SD1_CLK)
NetR407_1: R407.1 U101.C8(~{NAND_WE})
NetR408_1: R408.1 U101.E6(NAND_DQS)
NetR412_1: R412.1 U101.B4(NAND_ALE)
NetR413_1: R413.1 U101.A8(LCD_CLK)

### Notes on the sheet
- MX6ULL PERI
- # QSPI_DQS only for loop back mode test
- # LCD RGB
- # NAND/eMMC/MicroSD/QSPI
- # Camera
- # Layout: Route 90ohm DIFF
- # SD CARD FULL SIZE
- (near C417) # 100M MII/RMII
- (near TP402) # Ethernet / SPI
- (in symbol MCIMX6Y2DVM05AA_PBGA_289P, part D) i.MX6ULL - LCD; NVCC_LCD1
- (in symbol MCIMX6Y2DVM05AA_PBGA_289P, part E) i.MX6ULL - CSI
- (in symbol MCIMX6Y2DVM05AA_PBGA_289P, part F) i.MX6ULL- USB; LDO_USB
- (in symbol MCIMX6Y2DVM05AA_PBGA_289P, part G) i.MX6ULL - ADC
- (in symbol MCIMX6Y2DVM05AA_PBGA_289P, part H) i.MX6ULL - ENET
- (in symbol MCIMX6Y2DVM05AA_PBGA_289P, part I) i.MX6ULL - SD
- (in symbol MCIMX6Y2DVM05AA_PBGA_289P, part J) i.MX6ULL - NAND
- (in symbol MCIMX6Y2DVM05AA_PBGA_289P, part K) i.MX6ULL - GPIO
- (in symbol TitleBlock_FS) ICAP Classification:; CP:; IUO:; PUBI:; Drawing Title:; Page Title:; Size; Document Number; Rev; Date:; Sheet; of

### Library data of the parts
*#7 = TitleBlock_FS: as *#3 on sheet A-02 PWR TREE; FCP: ___; Page Create Date: March  8, 1995; Page Modify Date: *
C401-C403 C413 = CAP_NP: as C202 on sheet C-02 LvDDR3; HEIGHT: 0.55MM; ROHS: Yes; Tolerance: 10%
C404 C405 = CAP_NP: as C201 on sheet C-02 LvDDR3; Tolerance: 10%; ROHS: Yes; HEIGHT: 0.55MM
C407 C411 C412 = CAP_NP: CAP CER 1.0UF 10V 10% X5R 0402; CLASS: DISCRETE; AGILE_PN: 150-75772; MFG_NAME01: YAGEO AMERICA; MFG_PN01: CC0402KRX5R6BB105; CAD_APPROVED: Yes; FPLIST: CC0402_25,CC0402_HD,0402_CC; ROHS: Yes; HEIGHT: 0.6MM
C408 = CAP_NP: as C225 on sheet C-02 LvDDR3; ROHS: Yes; HEIGHT: 1.016MM
C409 = CAP_NP: as C303 on sheet C-03 eMMC_NAND_TF_QSPI; Tolerance: 10%; ROHS: Yes; HEIGHT: 0.55MM
C410 = CAP_NP: as C222 on sheet C-02 LvDDR3; HEIGHT: 0.55MM; ROHS: Yes; Tolerance: 10%
C414 = CAP_NP: CAP CER 820PF 50V 5% X7R 0402; CLASS: DISCRETE; FPLIST: CC0402_25,CC0402_HD,0402_CC; CAD_APPROVED: Yes; MFG_PN01: C0402C821J5RAC; MFG_NAME01: KEMET; AGILE_PN: 150-77973; PCB Footprint: 0402_CC; VOLTAGE: 50 V; HEIGHT: 0.6MM; ROHS: Yes; Tolerance: 5%
C415-C417 C420 C421 C423 = CAP_NP: CAP CER 18PF 50V 1% C0G 0402; CLASS: DISCRETE; FPLIST: CC0402_25,CC0402_HD,0402_CC; AGILE_PN: 150-76630; MFG_NAME01: CAPAX TECHNOLOGIES INC.; MFG_PN01: 0402G180F500SNT; CAD_APPROVED: Yes; PRIORITY_PN: 021-00248; ROOM: ATLAS-AP; Tolerance: 1%; ROHS: Yes; HEIGHT: 0.59MM
C418 C422 = CAP_NP: CAP CER 18PF 50V 1% C0G 0402; CLASS: DISCRETE; ROOM: ATLAS-AP; PRIORITY_PN: 021-00248; CAD_APPROVED: Yes; MFG_PN01: 0402G180F500SNT; MFG_NAME01: CAPAX TECHNOLOGIES INC.; AGILE_PN: 150-76630; FPLIST: CC0402_25,CC0402_HD,0402_CC; HEIGHT: 0.59MM; ROHS: Yes; Tolerance: 1%
R402 R403 = RES: RES MF 10K 1/16W 5% 0402; CLASS: DISCRETE; FPLIST: RC0402_25,RC0402_HD,0402_CC; CAD_APPROVED: Yes; MFG_PN01: CRCW040210K0JNED; MFG_NAME01: VISHAY INTERTECHNOLOGY; AGILE_PN: 470-75557; PCB Footprint: 0402_CC; ROHS: Yes; Tolerance: 5%
R404 R405 = RES: RES MF ZERO OHM 1/16W 5% 0402; CLASS: DISCRETE; AGILE_PN: 470-75394; MFG_NAME01: ROHM; MFG_PN01: MCR01MZPJ000; CAD_APPROVED: Yes; FPLIST: RC0402_25,RC0402_HD,RC0402_X2,0402_CC; PCB Footprint: 0402_CC; Tolerance: 5%; ROHS: Yes
R406 R409-R411 R413 = RES: RES MF 10 OHM 1/16W 5% 0402; CLASS: DISCRETE; FPLIST: RC0402_25,RC0402_HD,0402_CC; CAD_APPROVED: Yes; MFG_PN01: CR0402-16W-100JT; MFG_NAME01: VENKEL COMPANY; AGILE_PN: 470-75589; PCB Footprint: 0402_CC; ROHS: Yes; Tolerance: 5%
R407 R408 = RES: RES MF 10 OHM 1/16W 5% 0402; CLASS: DISCRETE; AGILE_PN: 470-75589; MFG_NAME01: VENKEL COMPANY; MFG_PN01: CR0402-16W-100JT; CAD_APPROVED: Yes; FPLIST: RC0402_25,RC0402_HD,0402_CC; PCB Footprint: 0402_CC; Tolerance: 5%; ROHS: Yes
R412 = RES: RES MF ZERO OHM 1/16W 5% 0402; CLASS: DISCRETE; PCB Footprint: 0402_CC; FPLIST: RC0402_25,RC0402_HD,RC0402_X2,0402_CC; CAD_APPROVED: Yes; MFG_PN01: MCR01MZPJ000; MFG_NAME01: ROHM; AGILE_PN: 470-75394; ROHS: Yes; Tolerance: 5%
TP402 = TESTLOOP: as TP202 on sheet C-02 LvDDR3; PCB Footprint: TPAD_015; HEIGHT: 0.1MM; ROHS: Yes; MFG_NAME01: NOTACOMPONENT
TP403 = TESTLOOP: as TP201 on sheet C-02 LvDDR3; PCB Footprint: TPAD_015; MFG_PN01: NOTACOMPONENT; ROHS: Yes; HEIGHT: 0.1MM
U101 = MCIMX6Y2DVM05AA_PBGA_289P: CLASS: IC